# EasyEDA Pro project ProPrj_ZYNQ7020_V1_2024-12-31.epro, schematic ZYNQ7020_1

## Sheets
1 BANK34/35: Board Name: ZYNQ7020_V1; Create Date: 2024-12-19; Page Name: BANK34/35; Project Name: ZYNQ7020_V1; Schematic Name: ZYNQ7020_1; Update Date: 2024-12-19; Company: 嘉立创EDA; Page Size: A4; Version: V1.0
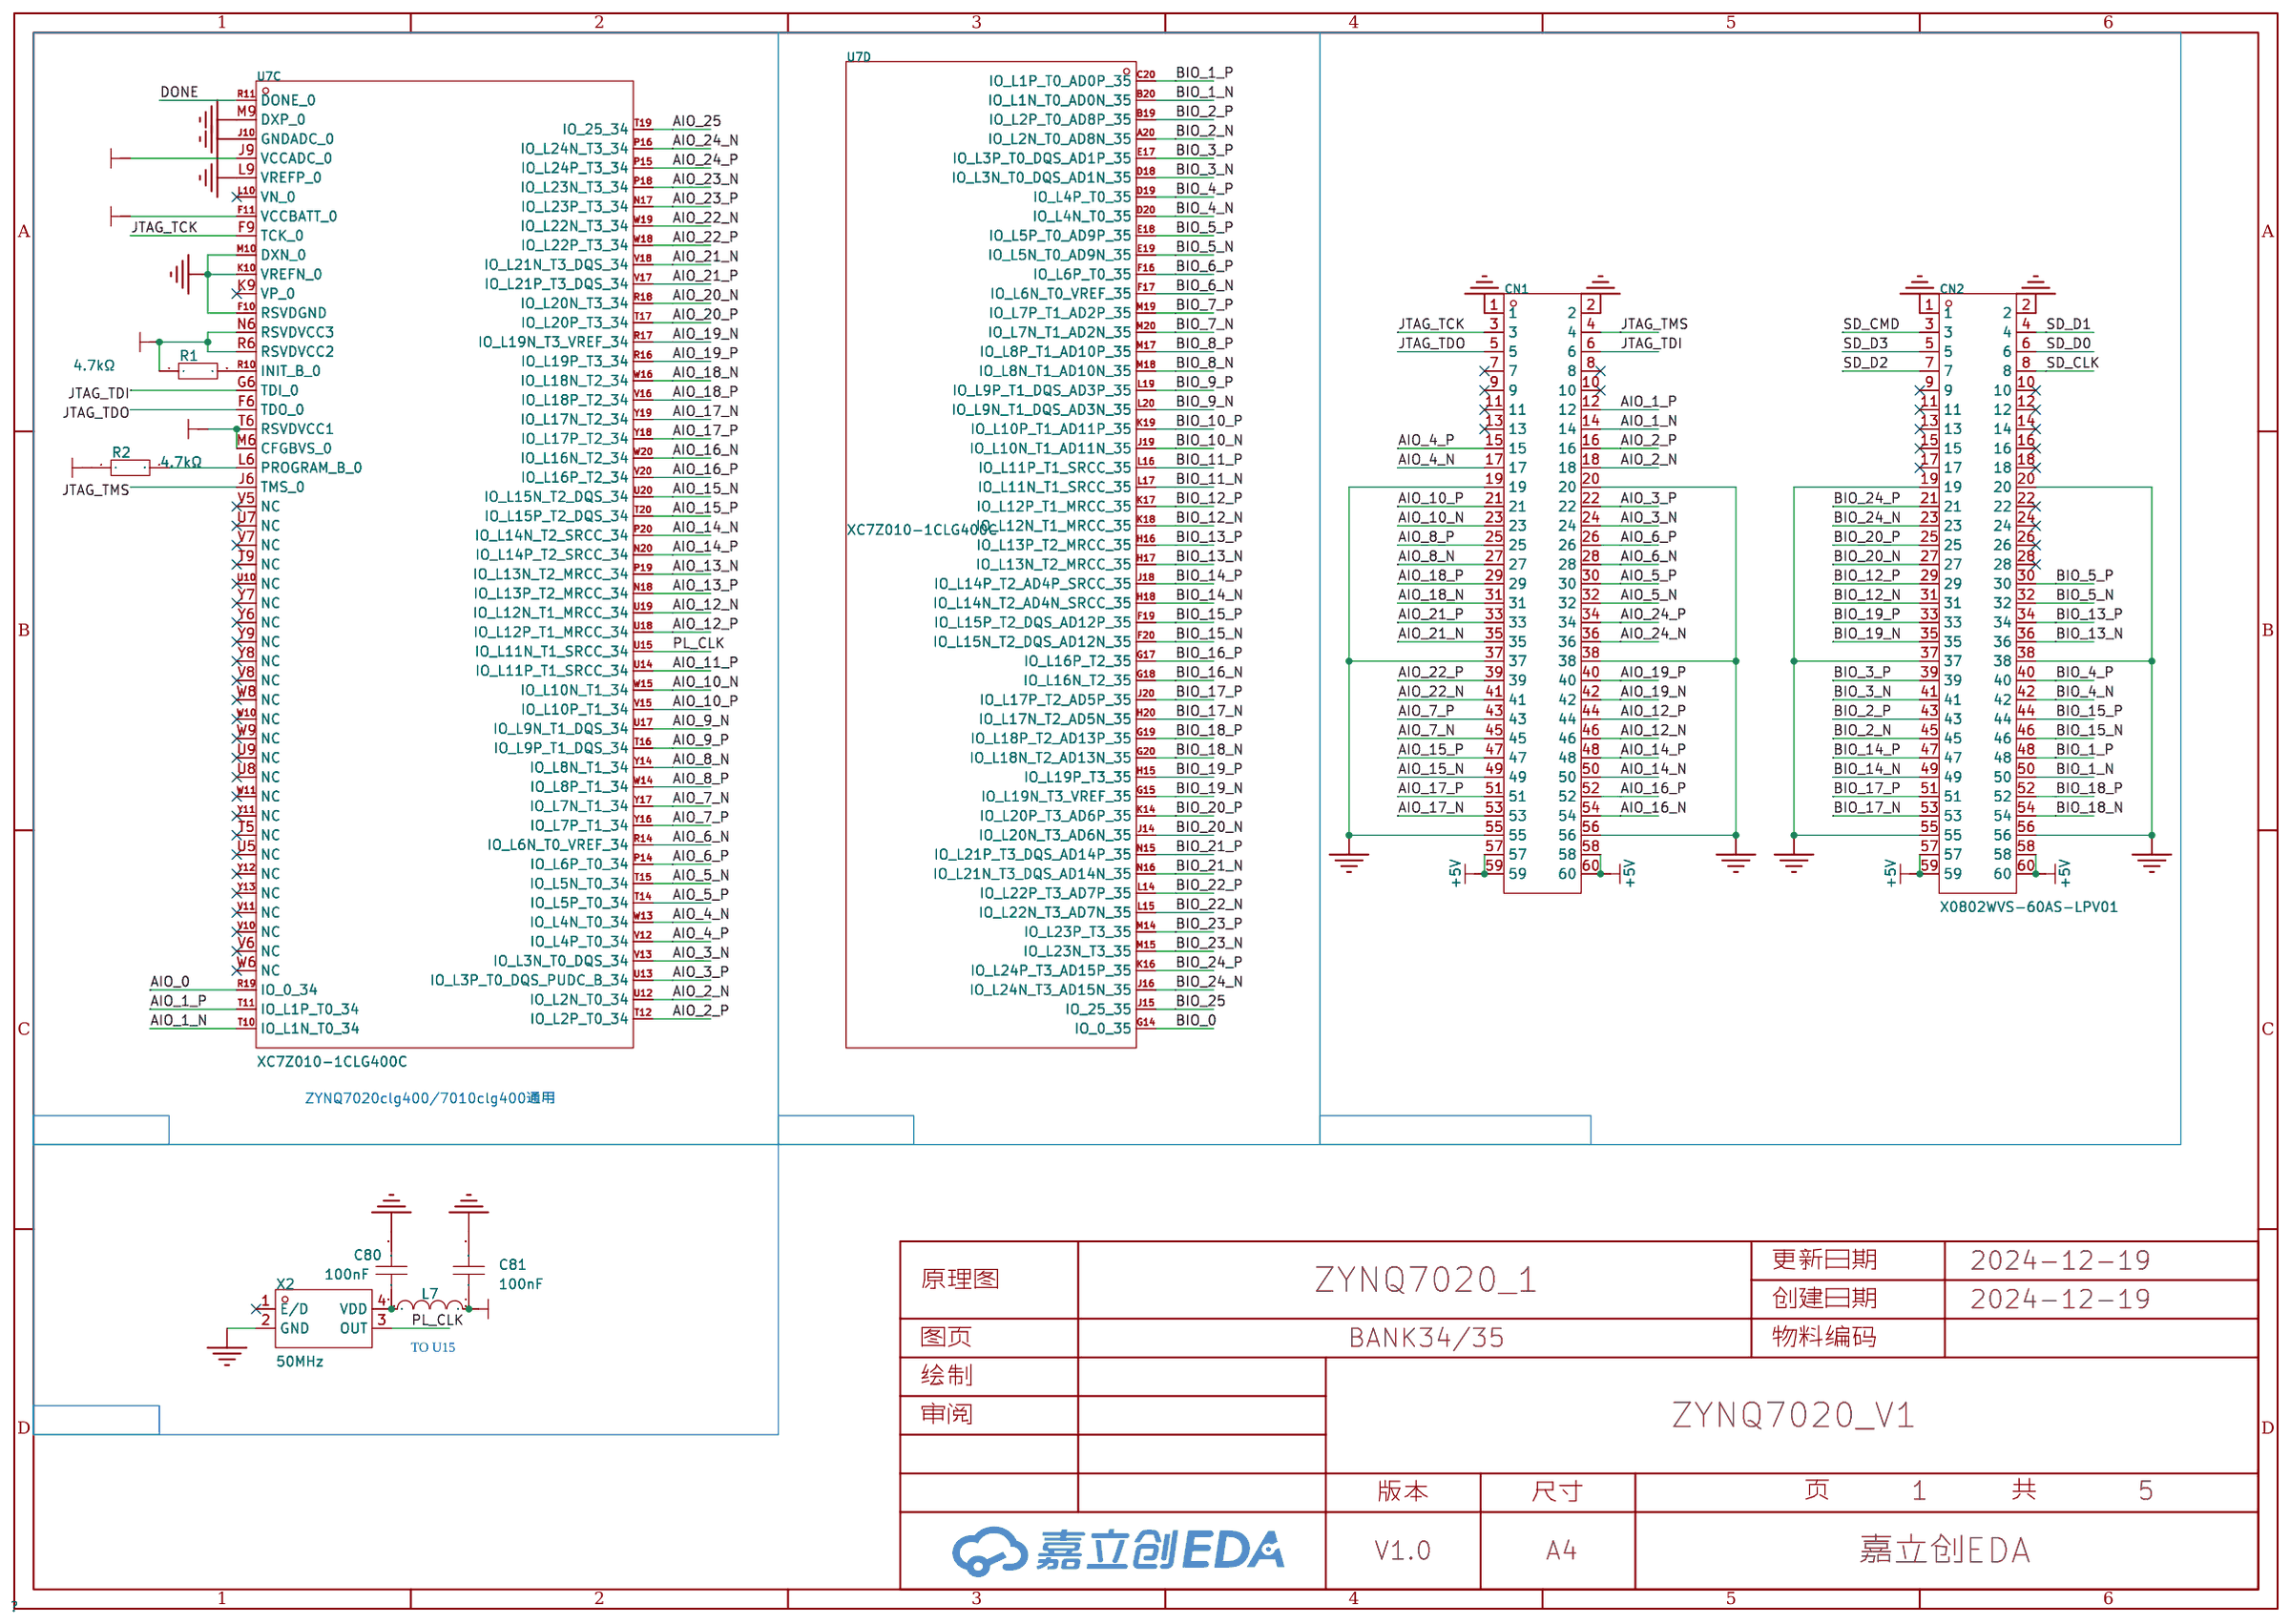
[diagram p0: BANK34/35]
2 POWER: Page Name: POWER
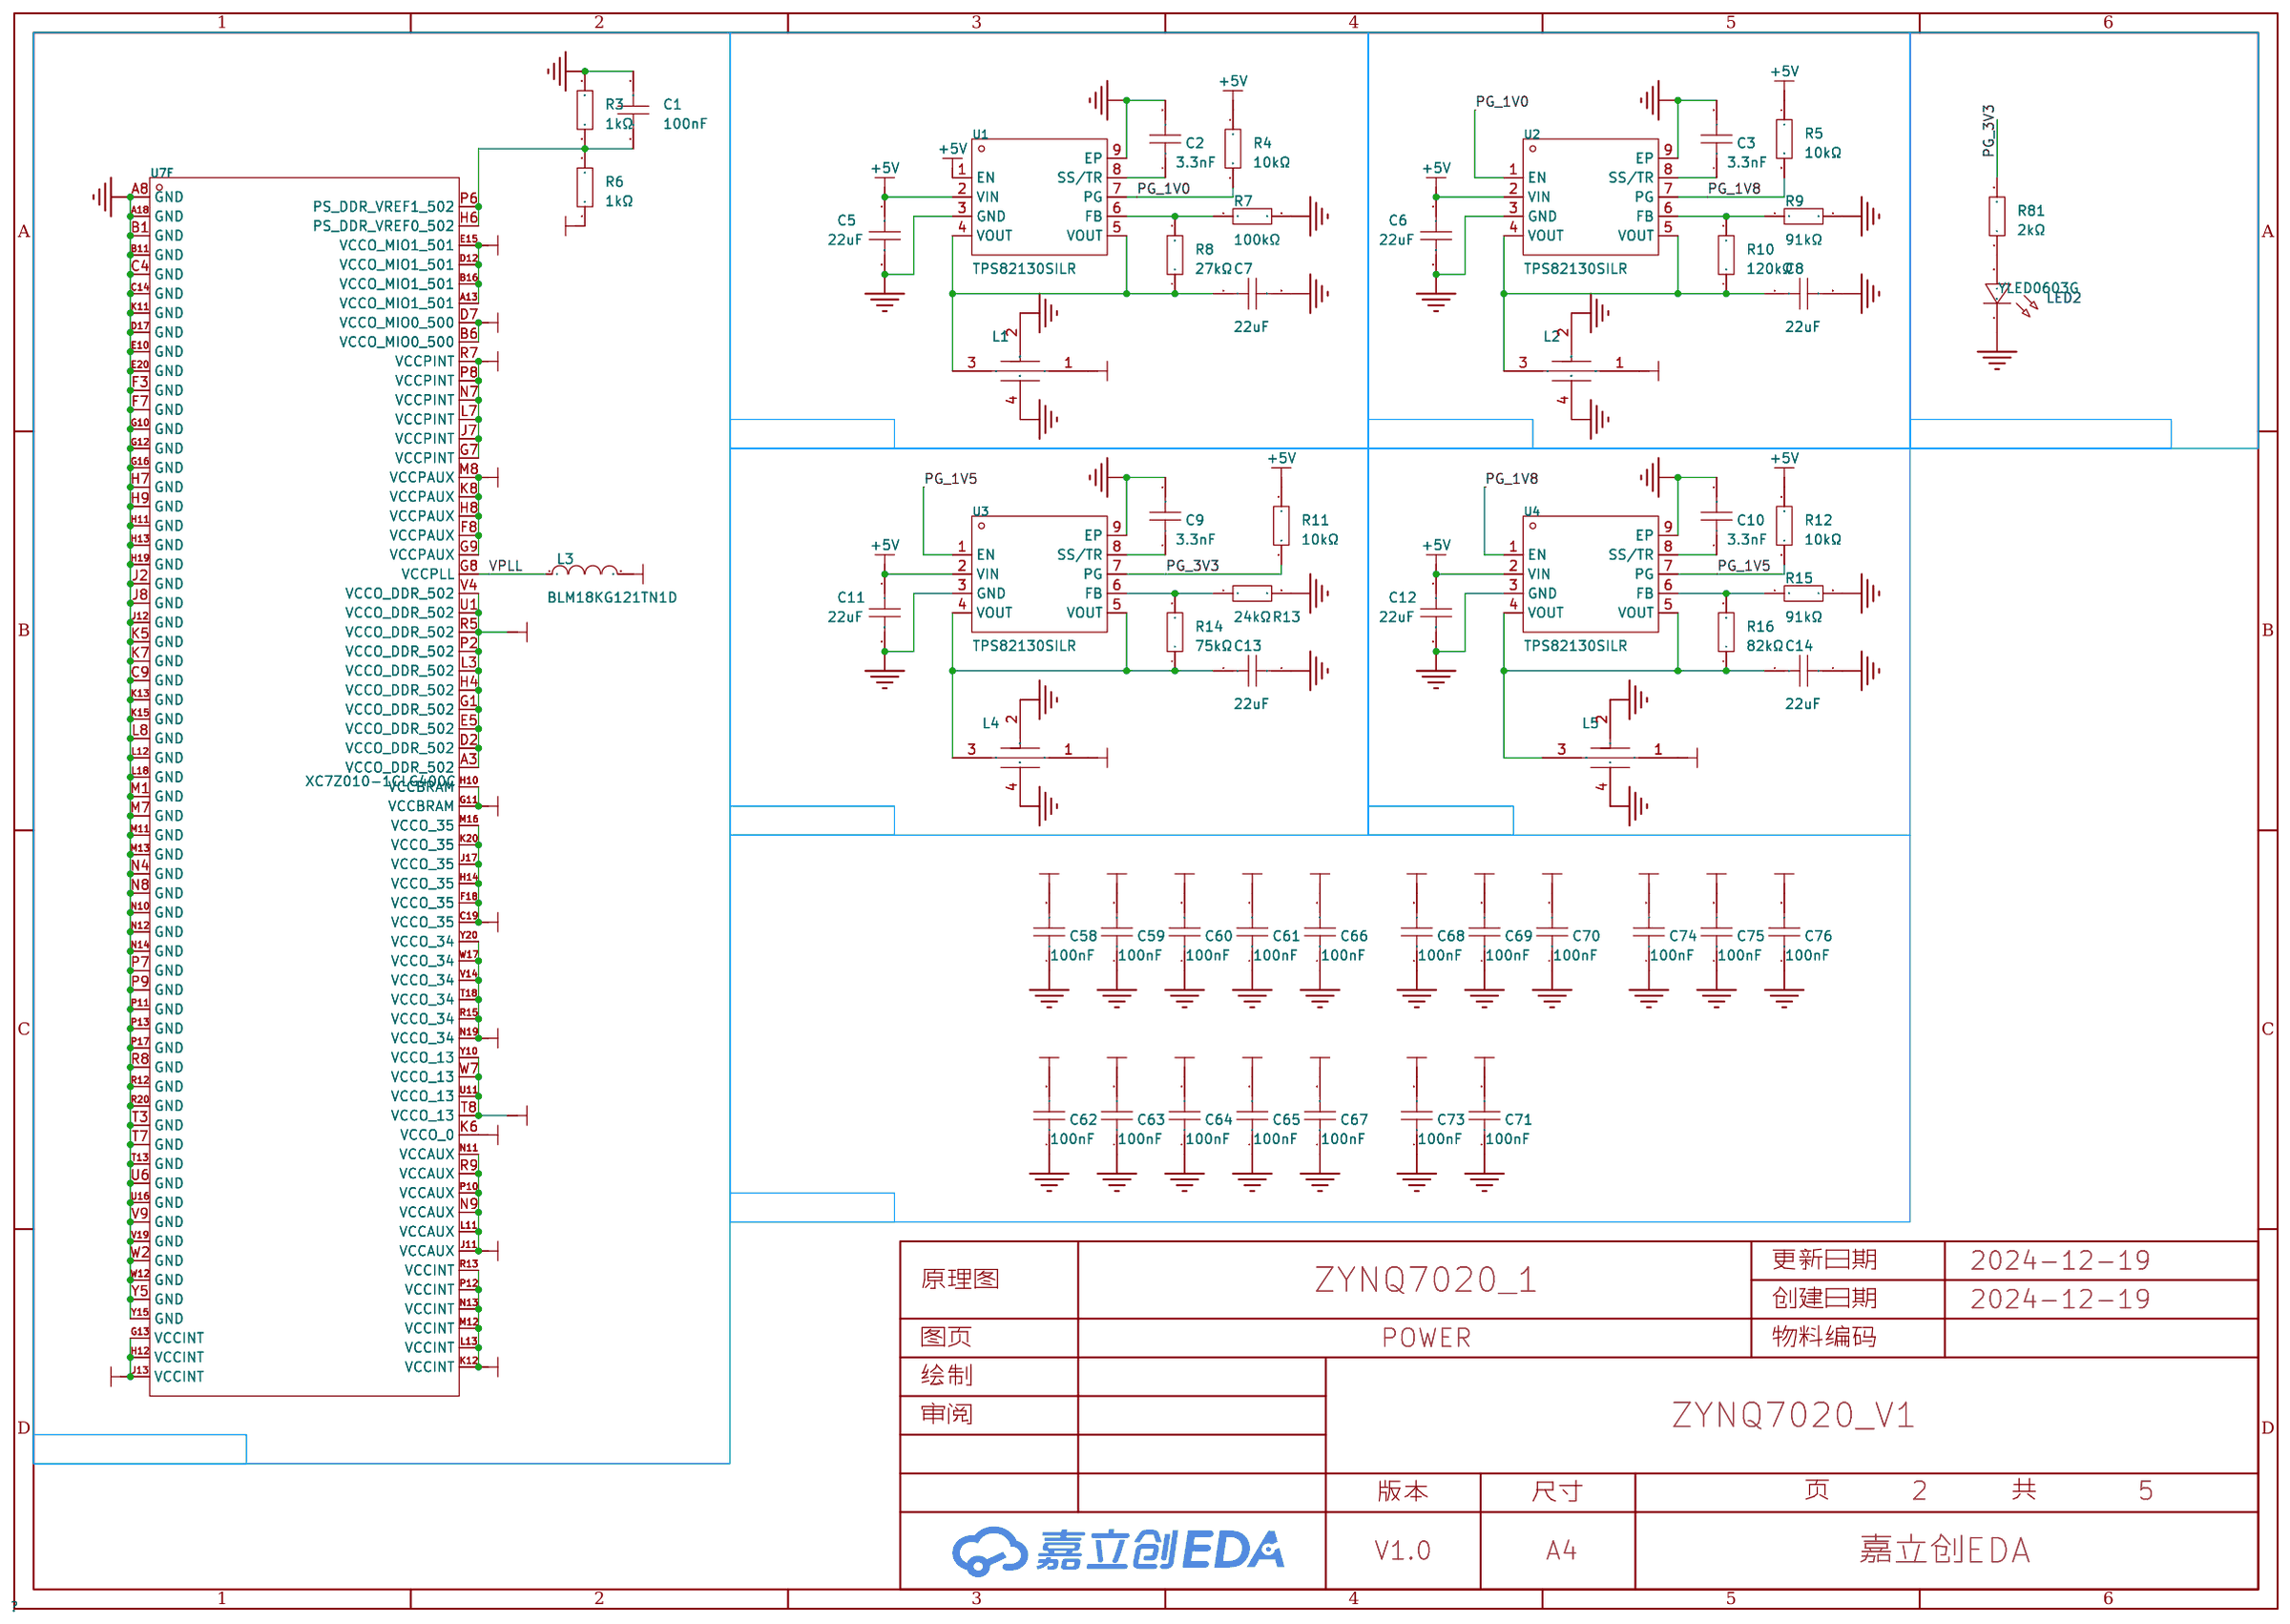
[diagram p1: POWER]
3 DDR3: Page Name: DDR3
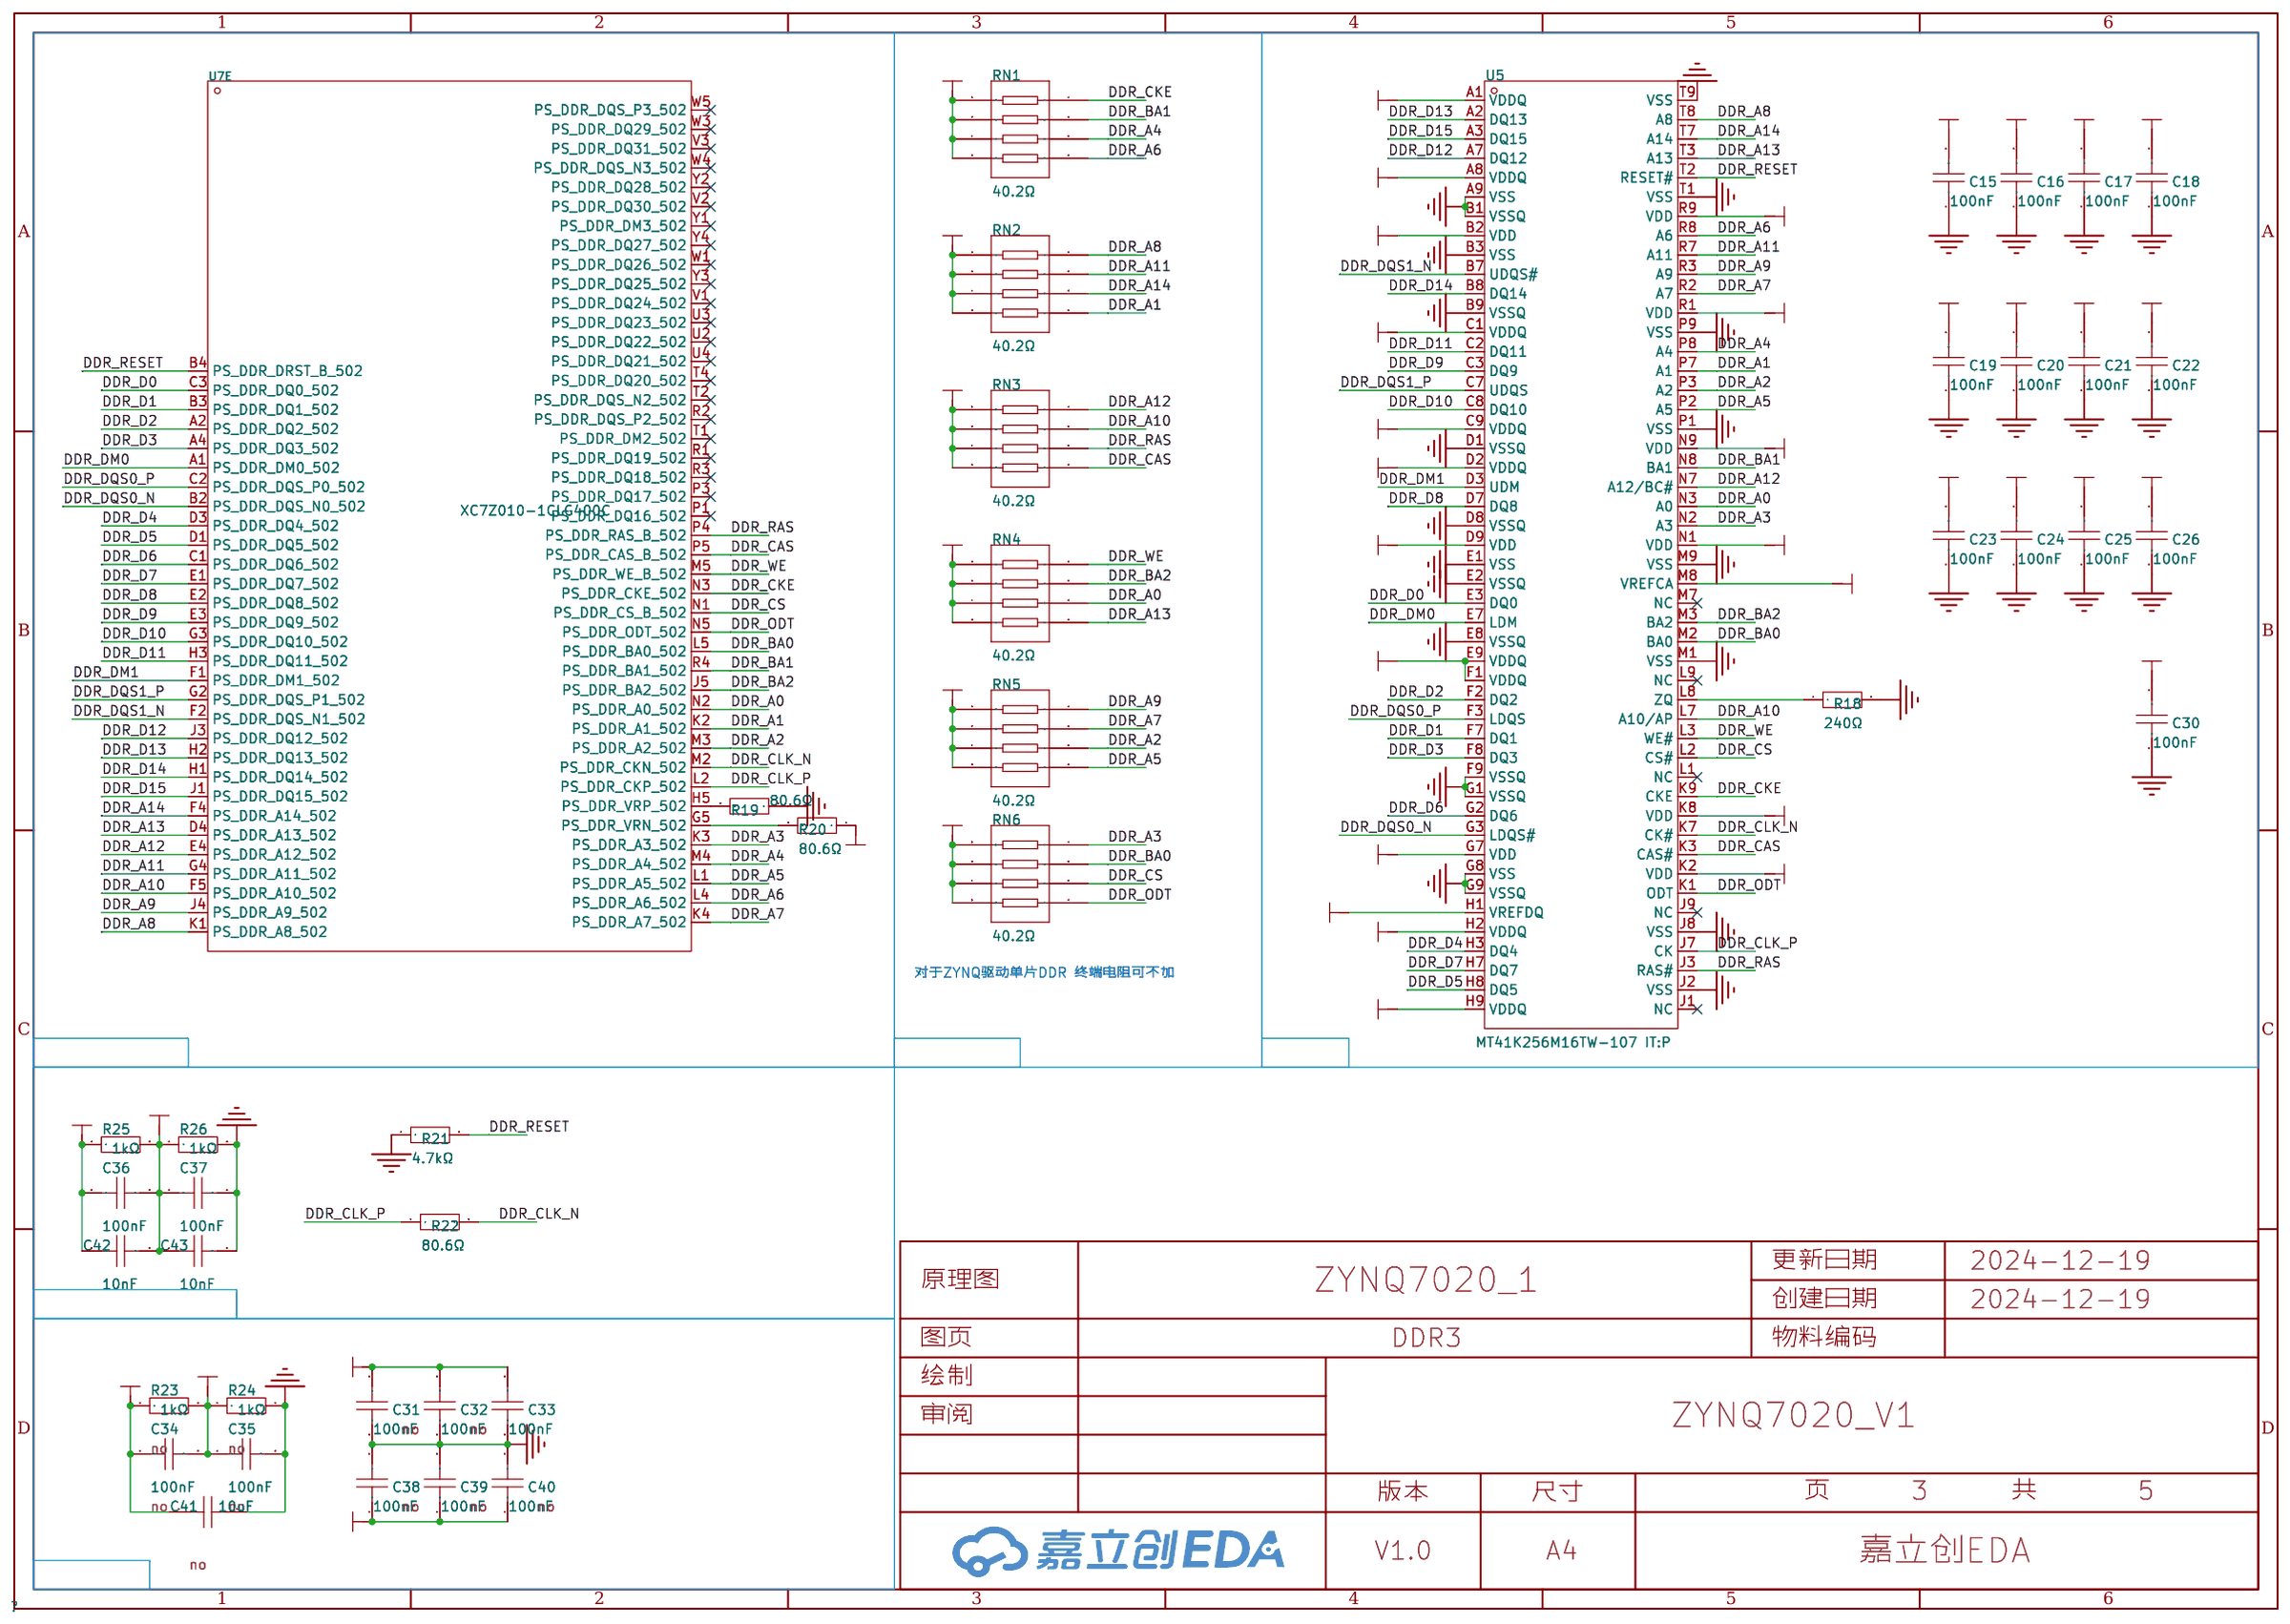
[diagram p2: DDR3]
4 BANK500/501: Page Name: BANK500/501
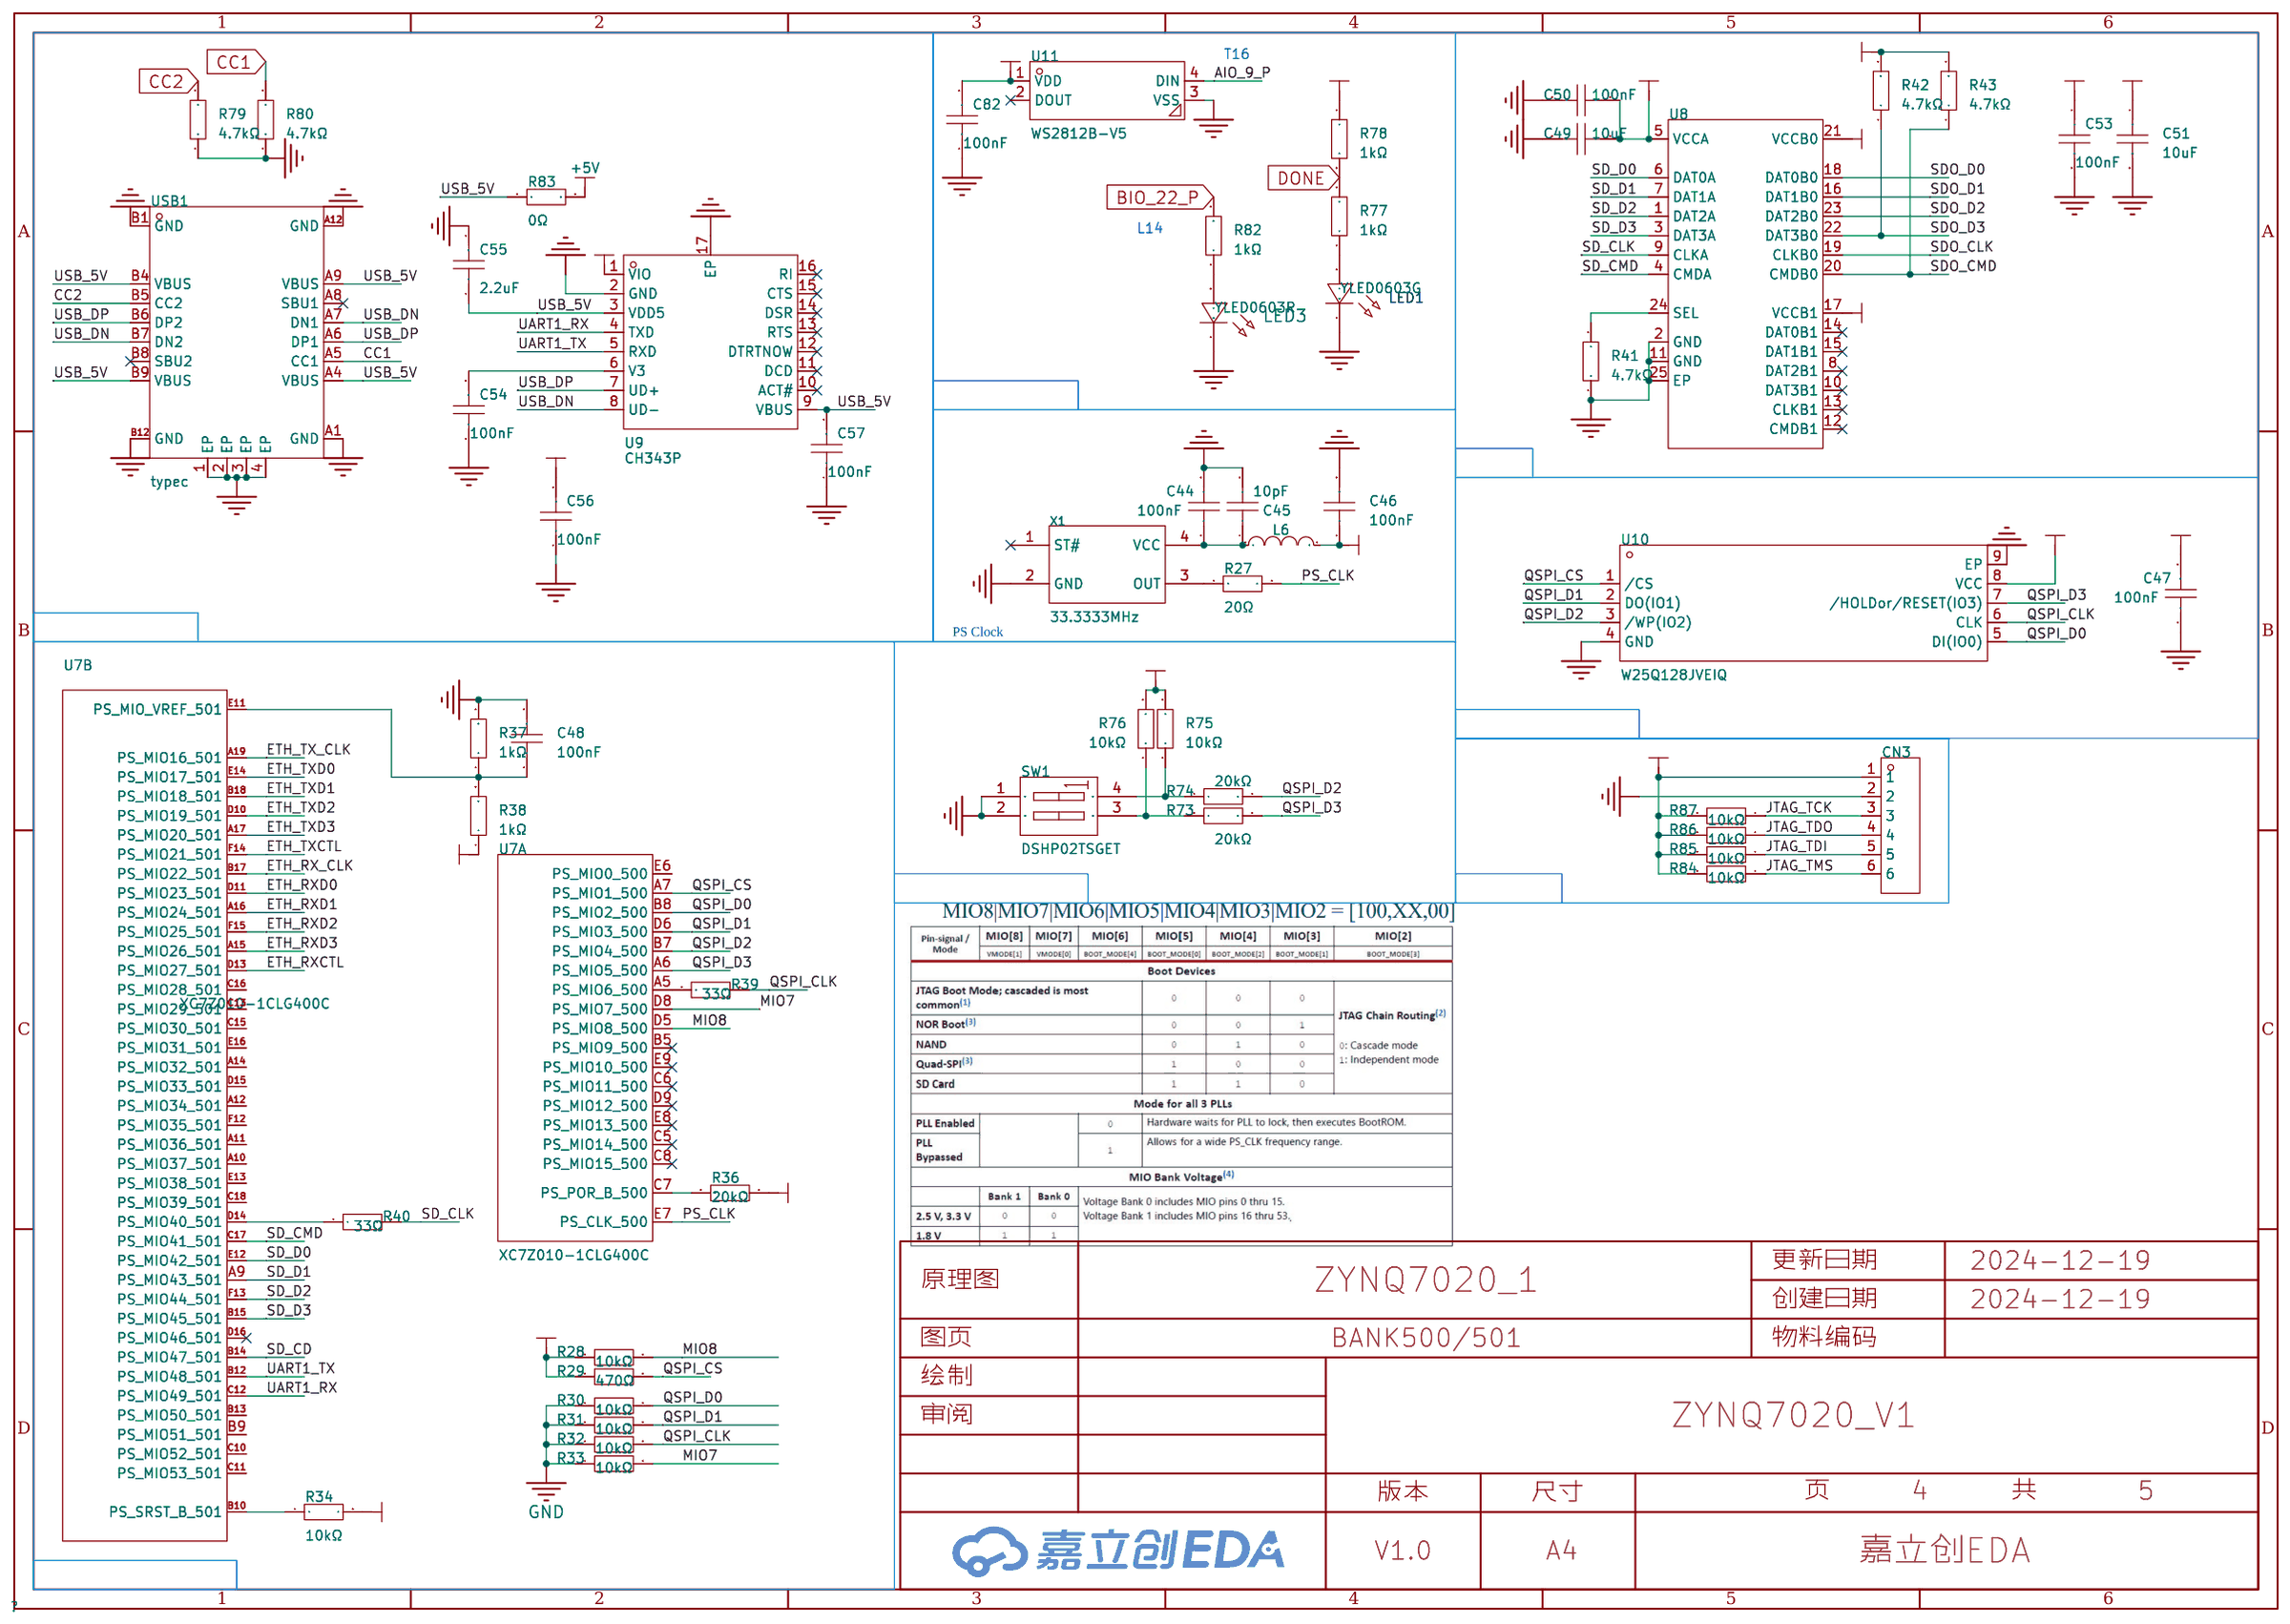
[diagram p3: BANK500/501]
5 CHANGELOG: Create Date: 2024-12-18; Page Name: CHANGELOG; Project Name: ZYNQ7020-core-board-series; Update Date: 2024-12-18
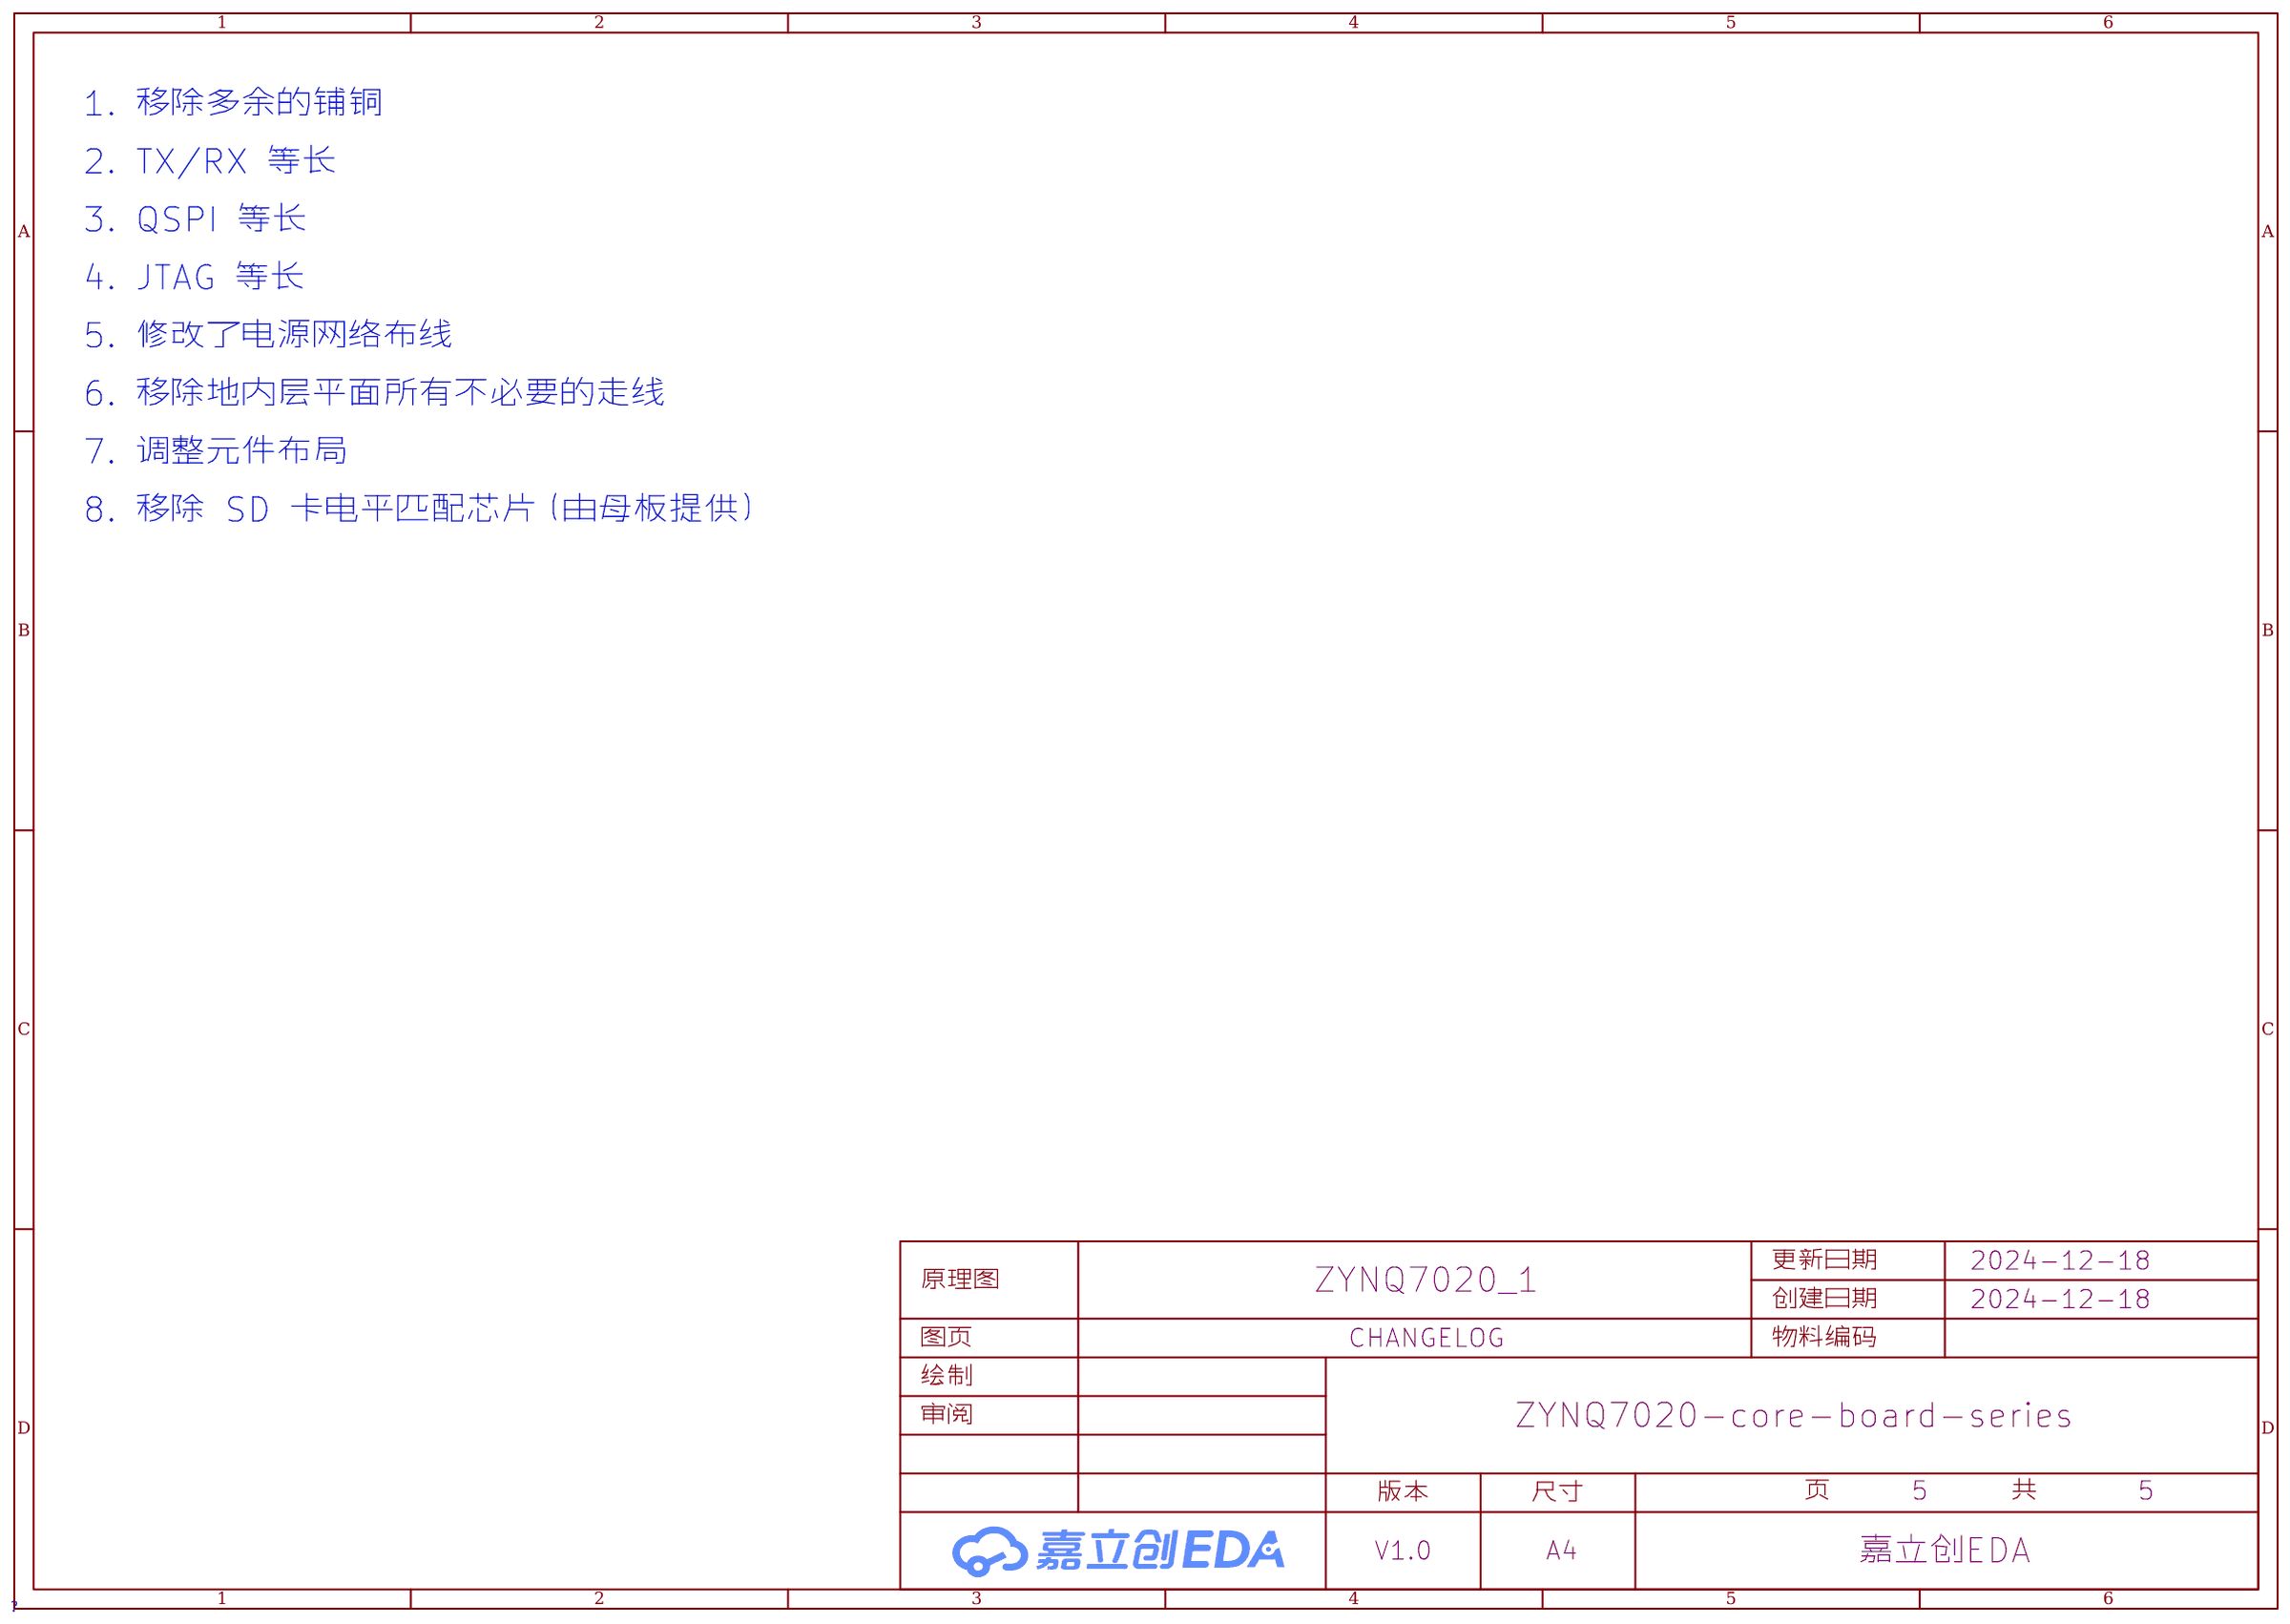
[diagram p4: CHANGELOG]

## Parts
sheet BANK34/35
C80  100nF  [C0402]
C81  100nF  [C0402]
CN1  X0802WVS-60AS-LPV01  [CONN-SMD_60P-P0.80_XKB_X0802WVS-60ADS-LPV01]
CN2  X0802WVS-60AS-LPV01  [CONN-SMD_60P-P0.80_XKB_X0802WVS-60ADS-LPV01]
L7  BLM18KG121TN1D  [L0603]
R1  4.7kΩ  [R0402]
R2  4.7kΩ  [R0402]
U7  XC7Z010-1CLG400C  [FBGA-400_L17.0-W17.0-R20-C20-P0.80-TL]  (sections 1,2,3,4,BANK500,BANK501)
X2  50MHz  [OSC-SMD_4P-L2.5-W2.0-BL]
sheet BANK500/501
C44  100nF  [C0402]
C45  10pF  [C0402]
C46  100nF  [C0402]
C47  100nF  [C0402]
C48  100nF  [C0402]
C49  10uF  [C0402]
C50  100nF  [C0402]
C51  10uF  [C0402]
C53  100nF  [C0402]
C54  100nF  [C0402]
C55  2.2uF  [C0402]
C56  100nF  [C0402]
C57  100nF  [C0402]
C82  100nF  [C0402]
CN3  X6511WRS-06H-C60D48  [HDR-SMD_6P-P2.54-H-M-W13.3-N]
L6  BLM18KG121TN1D  [L0603]
LED1  YLED0603G  [LED0603-FD]
LED3  YLED0603R  [LED0603-FD]
R27  20Ω  [R0402]
R28  10kΩ  [R0402]
R29  470Ω  [R0402]
R30  10kΩ  [R0402]
R31  10kΩ  [R0402]
R32  10kΩ  [R0402]
R33  10kΩ  [R0402]
R34  10kΩ  [R0402]
R36  20kΩ  [R0402]
R37  1kΩ  [R0402]
R38  1kΩ  [R0402]
R39  33Ω  [R0402]
R40  33Ω  [R0402]
R41  4.7kΩ  [R0402]
R42  4.7kΩ  [R0402]
R43  4.7kΩ  [R0402]
R73  20kΩ  [R0402]
R74  20kΩ  [R0402]
R75  10kΩ  [R0402]
R76  10kΩ  [R0402]
R77  1kΩ  [R0402]
R78  1kΩ  [R0402]
R79  4.7kΩ  [R0402]
R80  4.7kΩ  [R0402]
R82  1kΩ  [R0402]
R83  0Ω  [R0603]
R84  10kΩ  [R0402_NEW]
R85  10kΩ  [R0402_NEW]
R86  10kΩ  [R0402_NEW]
R87  10kΩ  [R0402_NEW]
SW1  DSHP02TSGET  [SW-SMD_4P_DSHP02TSGET]
U8  -  [WQFN-24_L4.0-W4.0-P0.50-TL-EP2.5]
U9  CH343P  [TQFN-16_L3.0-W3.0-P0.50-BL-EP1.7]
U10  W25Q128JVEIQ  [WSON-8_L6.0-W8.0-P1.27-BL-EP]
U11  WS2812B-V5  [LED-SMD_4P-L5.0-W5.0-TL_WS2812B-B]
USB1  typec  [USB-C-SMD_KH-TYPE-C-16P]
X1  33.3333MHz  [OSC-SMD_4P-L3.2-W2.5-BL]
sheet DDR3
C15  100nF  [C0402]
C16  100nF  [C0402]
C17  100nF  [C0402]
C18  100nF  [C0402]
C19  100nF  [C0402]
C20  100nF  [C0402]
C21  100nF  [C0402]
C22  100nF  [C0402]
C23  100nF  [C0402]
C24  100nF  [C0402]
C25  100nF  [C0402]
C26  100nF  [C0402]
C30  100nF  [C0402]
C31  100nF  [C0402]
C32  100nF  [C0402]
C33  100nF  [C0402]
C34  100nF  [C0402]
C35  100nF  [C0402]
C36  100nF  [C0402]
C37  100nF  [C0402]
C38  100nF  [C0402]
C39  100nF  [C0402]
C40  100nF  [C0402]
C41  10uF  [C0402]
C42  10nF  [C0402]
C43  10nF  [C0402]
R18  240Ω  [R0402]
R19  80.6Ω  [R0402]
R20  80.6Ω  [R0402]
R21  4.7kΩ  [R0402]
R22  80.6Ω  [R0402]
R23  1kΩ  [R0402]
R24  1kΩ  [R0402]
R25  1kΩ  [R0402]
R26  1kΩ  [R0402]
RN1  40.2Ω  [RES-ARRAY-SMD_0402-8P-L2.0-W1.0-BL]
RN2  40.2Ω  [RES-ARRAY-SMD_0402-8P-L2.0-W1.0-BL]
RN3  40.2Ω  [RES-ARRAY-SMD_0402-8P-L2.0-W1.0-BL]
RN4  40.2Ω  [RES-ARRAY-SMD_0402-8P-L2.0-W1.0-BL]
RN5  40.2Ω  [RES-ARRAY-SMD_0402-8P-L2.0-W1.0-BL]
RN6  40.2Ω  [RES-ARRAY-SMD_0402-8P-L2.0-W1.0-BL]
U5  MT41K256M16TW-107 IT:P  [FBGA-96_L14.0-W8.0-R16-C6-P0.80-TL]
sheet POWER
C1  100nF  [C0402]
C2  3.3nF  [C0402]
C3  3.3nF  [C0402]
C5  22uF  [C0805]
C6  22uF  [C0805]
C7  22uF  [C0805]
C8  22uF  [C0805]
C9  3.3nF  [C0402]
C10  3.3nF  [C0402]
C11  22uF  [C0805]
C12  22uF  [C0805]
C13  22uF  [C0805]
C14  22uF  [C0805]
C58  100nF  [C0402]
C59  100nF  [C0402]
C60  100nF  [C0402]
C61  100nF  [C0402]
C62  100nF  [C0402]
C63  100nF  [C0402]
C64  100nF  [C0402]
C65  100nF  [C0402]
C66  100nF  [C0402]
C67  100nF  [C0402]
C68  100nF  [C0402]
C69  100nF  [C0402]
C70  100nF  [C0402]
C71  100nF  [C0402]
C73  100nF  [C0402]
C74  100nF  [C0402]
C75  100nF  [C0402]
C76  100nF  [C0402]
L1  NFM21PC104R1E3D  [CAP-SMD_4P-L2.0-W1.25]
L2  NFM21PC104R1E3D  [CAP-SMD_4P-L2.0-W1.25]
L3  BLM18KG121TN1D  [L0603]
L4  NFM21PC104R1E3D  [CAP-SMD_4P-L2.0-W1.25]
L5  NFM21PC104R1E3D  [CAP-SMD_4P-L2.0-W1.25]
LED2  YLED0603G  [LED0603-FD]
R3  1kΩ  [R0402]
R4  10kΩ  [R0402]
R5  10kΩ  [R0402]
R6  1kΩ  [R0402]
R7  100kΩ  [R0402]
R8  27kΩ  [R0402]
R9  91kΩ  [R0402]
R10  120kΩ  [R0402]
R11  10kΩ  [R0402]
R12  10kΩ  [R0402]
R13  24kΩ  [R0402]
R14  75kΩ  [R0402]
R15  91kΩ  [R0402]
R16  82kΩ  [R0402]
R81  2kΩ  [R0402]
U1  TPS82130SILR  [USIP-8_L3.0-W2.8-P0.65-TL-EP]
U2  TPS82130SILR  [USIP-8_L3.0-W2.8-P0.65-TL-EP]
U3  TPS82130SILR  [USIP-8_L3.0-W2.8-P0.65-TL-EP]
U4  TPS82130SILR  [USIP-8_L3.0-W2.8-P0.65-TL-EP]

## Library data of the parts
C1 C15-C26 C30-C40 C44 C46-C48 C50 C53 C54 C56-C71 C73-C76 C80-C82 = GRM155R71H104KE14D: 容值:100nF;精度:±10%;额定电压:50V;材质(温度系数):X7R;; LCSC Part Name: 100nF ±10% 50V; Supplier Part: C77020; Manufacturer: muRata(村田); Supplier Footprint: 0402; JLCPCB Part Class: Extended Part; Datasheet: https://atta.szlcsc.com/upload/public/pdf/source/20180326/C77020_39BD49C951FF1AF0DB1F1FAC5AC1E401.pdf; Supplier: LCSC; Tolerance: ±10%; Voltage Rated: 50V; Temperature Coefficient: X7R
CN1 CN2 = X0802WVS-60AS-LPV01: PIN总数:60P;间距:0.8mm;公母:公;安装方式:立贴;行数:2;额定电流:500mA;工作温度范围:-25℃~+85℃;; LCSC Part Name: 间距:0.8mm PIN:60P 公 立贴; Supplier Part: C2925331; Manufacturer: XKB Connection(中国星坤); Supplier Footprint: SMD,P=0.8mm; JLCPCB Part Class: Extended Part; Datasheet: https://atta.szlcsc.com/upload/public/pdf/source/20211215/082FD9024D3D5655771ED54599ED55C7.pdf; Supplier: LCSC; Number of Pins: 60P; Pitch: 0.8mm; Number of Rows: 2; Gender: 公; Mounting Style: 立贴; Current Rating (Max): 500mA; Operating Temperature Range: -25℃~+85℃
L3 L6 L7 = BLM18KG121TN1D: 标称阻抗@测试频率:120Ω@100MHz;误差:±25%;直流电阻(RDC):30mΩ;; LCSC Part Name: 单路 0603磁珠 阻抗120Ω@100MHz; Supplier Part: C85831; Manufacturer: muRata(村田); Supplier Footprint: 0603; JLCPCB Part Class: Extended Part; Datasheet: https://atta.szlcsc.com/upload/public/pdf/source/20180329/C160981_FD3C2D2622A377E203B89F4AA32B0741.pdf; Supplier: LCSC; Impedance @ Frequency: 120Ω@100MHz; Tolerance: ±25%; DC Resistance: 30mΩ; Current Rating: 3A; Circuits: 1
R1 R2 R21 R41-R43 R79 R80 = 0402WGF4701TCE: 电阻类型:厚膜电阻;阻值:4.7kΩ;精度:±1%;功率:62.5mW;最大工作电压:50V;温度系数:±100ppm/℃;; LCSC Part Name: 4.7kΩ ±1% 62.5mW 厚膜电阻; Supplier Part: C25900; Manufacturer: UNI-ROYAL(厚声); Supplier Footprint: 0402; JLCPCB Part Class: Basic Part; Datasheet: https://atta.szlcsc.com/upload/public/pdf/source/20200306/C422600_1E6D84923E4A46A82E41ADD87F860B5C.pdf; Supplier: LCSC; Type: 厚膜电阻; Tolerance: ±1%; Power(Watts): 62.5mW; Overload Voltage (Max): 50V; Temperature Coefficient: ±100ppm/℃; Operating Temperature Range: -55℃~+155℃
U7 = XC7Z010-1CLG400C_C2843417: Supplier Part: C2843417; Manufacturer: XILINX(赛灵思); Supplier Footprint: CSPBGA-400; JLCPCB Part Class: Extended Part; Datasheet: https://atta.szlcsc.com/upload/public/pdf/source/20191108/C446028_7ED8319F1F88212BA1E5D387DA4ECDB9.pdf; Supplier: LCSC
X2 = OT252050MJBA4SL: 频率:50MHz;工作电压:1.8V~3.3V;频率稳定度:±10ppm;; LCSC Part Name: 50MHz ±10ppm 1.8V~3.3V YSO110TR; Supplier Part: C669074; Manufacturer: YXC(扬兴晶振); Supplier Footprint: SMD2520-4P; JLCPCB Part Class: 扩展库; Datasheet: https://atta.szlcsc.com/upload/public/pdf/source/20210329/C669065_30B18CFE780D377BA4E84F6ED1951959.pdf; Supplier: LCSC; Supply Voltage: 1.8V~3.3V; Supply Current (Max): 12mA; Frequency Stability: ±10ppm; Operating Temperature: -40℃~+85℃
C45 = GJM1555C1H100FB01D: 容值:10pF;精度:±1%;额定电压:50V;材质(温度系数):C0G;; LCSC Part Name: 10pF ±1% 50V; Supplier Part: C782046; Manufacturer: muRata(村田); Supplier Footprint: 0402; JLCPCB Part Class: Extended Part; Datasheet: https://atta.szlcsc.com/upload/public/pdf/source/20200908/C782046_6B495CB8BB5186DFA61FAFE383A0F7E0.pdf; Supplier: LCSC; Tolerance: ±1%; Voltage Rated: 50V; Temperature Coefficient: C0G
C41 C49 C51 = CL05A106MP5NUNC: 容值:10uF;精度:±20%;额定电压:10V;材质(温度系数):X5R;; LCSC Part Name: 10uF ±20% 10V; Supplier Part: C315248; Manufacturer: SAMSUNG(三星); Supplier Footprint: 0402; JLCPCB Part Class: Extended Part; Datasheet: https://atta.szlcsc.com/upload/public/pdf/source/20231220/1EF805BAE1520675928CC4638D279E74.pdf; Supplier: LCSC; Tolerance: ±20%; Voltage Rated: 10V; Temperature Coefficient: X5R
C55 = GRM155R61E225KE11D: 容值:2.2uF;精度:±10%;额定电压:25V;材质(温度系数):X5R;; LCSC Part Name: 2.2uF ±10% 25V; Supplier Part: C385032; Manufacturer: muRata(村田); Supplier Footprint: 0402; JLCPCB Part Class: Extended Part; Datasheet: https://atta.szlcsc.com/upload/public/pdf/source/20190531/C385032_AE390FF415271BC6A7223A7F56F516ED.pdf; Supplier: LCSC; Tolerance: ±10%; Voltage Rated: 25V; Temperature Coefficient: X5R
CN3 = X6511WRS-06H-C60D48: 插针结构:1x6P;间距:2.54mm;行距:2.54mm;圆针/方针:方针;安装类型:-;排数:单排;总PIN位数:6P;额定电流:3A;额定电压:250V;配合针长度:-;塑高:2.5mm;端接针长度:-;触头材质:黄铜;触头镀层:金;工作温度范围:-40℃~+105℃;焊接温度(最大值):260℃;颜色:黑色;; LCSC Part Name: 1x6P 间距:2.54mm 方针; Supplier Part: C5242199; Manufacturer: XKB Connection(中国星坤); Supplier Footprint: SMD,P=2.54mm; JLCPCB Part Class: 扩展库; Datasheet: https://atta.szlcsc.com/upload/public/pdf/source/20221103/EADF72CF36CD96D511D8188ACEE72315.pdf; Supplier: LCSC; Pin Structure: 1x6P; Pitch: 2.54mm; Row Spacing: 2.54mm; Circluar Pins/Square Pins: 方针; Number of Rows: 单排; Number of Pins: 6P; Current Rating (Max): 3A; Voltage Rating (Max): 250V; Insulation Height: 2.5mm; Contact Material: 黄铜; Contact Plating: 金; Operating Temperature Range: -40℃~+105℃; Soldering Temperature(Max): 260℃; Color: 黑色
LED1 LED2 = YLED0603G: 发光颜色:翠绿色;正向电压(VF):2.7V~3.2V;功率:-;正向电流:25mA;主波长:510nm~531nm;二极管配置:-;透镜颜色:-;色温:-;发光强度:-;发光角度:-;载带方式:-;工作温度:-40℃~+85℃;; Supplier Part: C19273151; Manufacturer: YONGYUTAI(永裕泰); Supplier Footprint: 0603; JLCPCB Part Class: Extended Part; Datasheet: https://atta.szlcsc.com/upload/public/pdf/source/20231201/6896CD173B7817C61CFF421DECB2B9C4.pdf; Supplier: LCSC; Emitted Color: 翠绿色; Forward Voltage (VF): 2.7V~3.2V; Forward Current: 25mA; Dominant Wavelength: 510nm~531nm; Operating Temperature: -40℃~+85℃
LED3 = YLED0603R: 发光颜色:红色;正向电压(VF):1.8V~2.4V;功率:-;正向电流:25mA;主波长:620nm~625nm;二极管配置:-;透镜颜色:-;色温:-;发光强度:-;发光角度:-;载带方式:-;工作温度:-40℃~+85℃;; Supplier Part: C19171390; Manufacturer: YONGYUTAI(永裕泰); Supplier Footprint: 0603; JLCPCB Part Class: Extended Part; Datasheet: https://atta.szlcsc.com/upload/public/pdf/source/20231027/FB19AF06E2C70028E58AB5CEDD1BDC72.pdf; Supplier: LCSC; Emitted Color: 红色; Forward Voltage (VF): 1.8V~2.4V; Forward Current: 25mA; Dominant Wavelength: 620nm~625nm; Operating Temperature: -40℃~+85℃
R27 = 0402WGF200JTCE: 电阻类型:厚膜电阻;阻值:20Ω;精度:±1%;功率:62.5mW;最大工作电压:50V;温度系数:±200ppm/℃;; LCSC Part Name: 20Ω ±1% 62.5mW 厚膜电阻; Supplier Part: C25089; Manufacturer: UNI-ROYAL(厚声); Supplier Footprint: 0402; JLCPCB Part Class: Extended Part; Datasheet: https://atta.szlcsc.com/upload/public/pdf/source/20200306/C422600_1E6D84923E4A46A82E41ADD87F860B5C.pdf; Supplier: LCSC; Type: 厚膜电阻; Tolerance: ±1%; Power(Watts): 62.5mW; Overload Voltage (Max): 50V; Temperature Coefficient: ±200ppm/℃; Operating Temperature Range: -55℃~+155℃
R4 R5 R11 R12 R28 R30-R34 R75 R76 R84-R87 = 0402WGF1002TCE: 电阻类型:厚膜电阻;阻值:10kΩ;精度:±1%;功率:62.5mW;最大工作电压:50V;温度系数:±100ppm/℃;; LCSC Part Name: 10kΩ ±1% 62.5mW 厚膜电阻; Supplier Part: C25744; Manufacturer: UNI-ROYAL(厚声); Supplier Footprint: 0402; JLCPCB Part Class: Basic Part; Datasheet: https://atta.szlcsc.com/upload/public/pdf/source/20200306/C422600_1E6D84923E4A46A82E41ADD87F860B5C.pdf; Supplier: LCSC; Type: 厚膜电阻; Tolerance: ±1%; Power(Watts): 62.5mW; Overload Voltage (Max): 50V; Temperature Coefficient: ±100ppm/℃; Operating Temperature Range: -55℃~+155℃
R29 = 0402WGF4700TCE: 电阻类型:厚膜电阻;阻值:470Ω;精度:±1%;功率:62.5mW;最大工作电压:50V;温度系数:±100ppm/℃;; LCSC Part Name: 470Ω ±1% 62.5mW 厚膜电阻; Supplier Part: C25117; Manufacturer: UNI-ROYAL(厚声); Supplier Footprint: 0402; JLCPCB Part Class: Basic Part; Datasheet: https://atta.szlcsc.com/upload/public/pdf/source/20200306/C422600_1E6D84923E4A46A82E41ADD87F860B5C.pdf; Supplier: LCSC; Type: 厚膜电阻; Tolerance: ±1%; Power(Watts): 62.5mW; Overload Voltage (Max): 50V; Temperature Coefficient: ±100ppm/℃; Operating Temperature Range: -55℃~+155℃
R36 = 0402WGF2002TCE: 电阻类型:厚膜电阻;阻值:20kΩ;精度:±1%;功率:62.5mW;最大工作电压:50V;温度系数:±100ppm/℃;; LCSC Part Name: 20kΩ ±1% 62.5mW; Supplier Part: C25765; Manufacturer: UNI-ROYAL(厚声); Supplier Footprint: 0402; JLCPCB Part Class: 基础库; Datasheet: https://atta.szlcsc.com/upload/public/pdf/source/20200306/C422600_1E6D84923E4A46A82E41ADD87F860B5C.pdf; Supplier: LCSC; Type: 厚膜电阻; Tolerance: ±1%; Power(Watts): 62.5mW; Temperature Coefficient: ±100ppm/℃; Overload Voltage (Max): 50V; Operating Temperature Range: -55℃~+155℃
R3 R6 R23-R26 R37 R38 R77 R78 R82 = 0402WGF1001TCE: 电阻类型:厚膜电阻;阻值:1kΩ;精度:±1%;功率:62.5mW;最大工作电压:50V;温度系数:±100ppm/℃;; LCSC Part Name: 1kΩ ±1% 62.5mW 厚膜电阻; Supplier Part: C11702; Manufacturer: UNI-ROYAL(厚声); Supplier Footprint: 0402; JLCPCB Part Class: Basic Part; Datasheet: https://atta.szlcsc.com/upload/public/pdf/source/20200306/C422600_1E6D84923E4A46A82E41ADD87F860B5C.pdf; Supplier: LCSC; Type: 厚膜电阻; Tolerance: ±1%; Power(Watts): 62.5mW; Overload Voltage (Max): 50V; Temperature Coefficient: ±100ppm/℃; Operating Temperature Range: -55℃~+155℃
R39 R40 = 0402WGF330JTCE: 电阻类型:厚膜电阻;阻值:33Ω;精度:±1%;功率:62.5mW;最大工作电压:50V;温度系数:±100ppm/℃;; LCSC Part Name: 33Ω ±1% 62.5mW 厚膜电阻; Supplier Part: C25105; Manufacturer: UNI-ROYAL(厚声); Supplier Footprint: 0402; JLCPCB Part Class: Basic Part; Datasheet: https://atta.szlcsc.com/upload/public/pdf/source/20200306/C422600_1E6D84923E4A46A82E41ADD87F860B5C.pdf; Supplier: LCSC; Type: 厚膜电阻; Tolerance: ±1%; Power(Watts): 62.5mW; Overload Voltage (Max): 50V; Temperature Coefficient: ±100ppm/℃; Operating Temperature Range: -55℃~+155℃
R73 R74 = 0402WGF2002TCE: 电阻类型:厚膜电阻;阻值:20kΩ;精度:±1%;功率:62.5mW;最大工作电压:50V;温度系数:±100ppm/℃;; LCSC Part Name: 20kΩ ±1% 62.5mW 厚膜电阻; Supplier Part: C25765; Manufacturer: UNI-ROYAL(厚声); Supplier Footprint: 0402; JLCPCB Part Class: Basic Part; Datasheet: https://atta.szlcsc.com/upload/public/pdf/source/20200306/C422600_1E6D84923E4A46A82E41ADD87F860B5C.pdf; Supplier: LCSC; Type: 厚膜电阻; Tolerance: ±1%; Power(Watts): 62.5mW; Temperature Coefficient: ±100ppm/℃; Overload Voltage (Max): 50V; Operating Temperature Range: -55℃~+155℃
R83 = 0603WAF0000T5E: 电阻类型:厚膜电阻;阻值:0Ω;精度:±1%;功率:100mW;最大工作电压:75V;; LCSC Part Name: 0Ω ±1% 100mW 厚膜电阻; Supplier Part: C21189; Manufacturer: UNI-ROYAL(厚声); Supplier Footprint: 0603; JLCPCB Part Class: Basic Part; Datasheet: https://atta.szlcsc.com/upload/public/pdf/source/20200306/C422600_1E6D84923E4A46A82E41ADD87F860B5C.pdf; Supplier: LCSC; Type: 厚膜电阻; Tolerance: ±1%; Power(Watts): 100mW; Overload Voltage (Max): 75V; Operating Temperature Range: -55℃~+155℃
SW1 = DSHP02TSGET: 类型:平拨，凹槽式;电路结构:单刀单掷;开关位数:2;引脚间距:1.27mm;颜色:黑色;; LCSC Part Name: 2位 1.27间距; Supplier Part: C40735; Manufacturer: YE; Supplier Footprint: SMD-4P,4.1x5.4mm; JLCPCB Part Class: Extended Part; Datasheet: https://atta.szlcsc.com/upload/public/pdf/source/20150928/1457707425261.pdf; Supplier: LCSC; Type: 平拨，凹槽式; Circuit: 单刀单掷; Number of Positions: 2; Lead Pitch: 1.27mm; Color: 黑色
U8 = TXS02612RTWR: TXS02612 具有电压电平转换功能的 SDIO 端口扩展器; Supplier Part: C140276; Manufacturer: TI(德州仪器); Supplier Footprint: WQFN-24_EP; JLCPCB Part Class: 扩展库; Datasheet: https://atta.szlcsc.com/upload/public/pdf/source/20180326/C140276_E5B046A739454B25517A7E1AD4B10154.pdf; Supplier: LCSC
U9 = CH343P: 应用功能:-;接口协议:-;; Supplier Part: C2846043; Manufacturer: WCH(南京沁恒); Supplier Footprint: TQFN-16-EP(3x3); JLCPCB Part Class: 扩展库; Datasheet: https://atta.szlcsc.com/upload/public/pdf/source/20211010/C2846043_7FA705E1F14A2906F6A2AFA45FA28209.pdf; Supplier: LCSC
U10 = W25Q128JVEIQ: Supplier Part: C401662; Manufacturer: WINBOND(华邦); Supplier Footprint: WSON-8-EP(6x8); JLCPCB Part Class: 扩展库; Datasheet: https://atta.szlcsc.com/upload/public/pdf/source/20190705/C401662_06B6D416F67ED315879B366F63A3F7C9.pdf; Supplier: LCSC
U11 = WS2812B-V5: Supplier Part: C691873; Supplier Footprint: SMD,5x5mm; Supplier: LCSC
USB1 = typec: Supplier Part: C9900016956; Supplier Footprint: typec 12p; JLCPCB Part Class: 扩展库; Supplier: LCSC
X1 = OT322533.3333MJBA4SL: 频率:33.3333MHz;常温频差:±10ppm;输出模式:CMOS;工作电压:1.8V~3.3V;频率稳定度(全温):±20ppm;; LCSC Part Name: 33.3333MHz ±10ppm 1.8V~3.3V YSO110TR; Supplier Part: C2831392; Manufacturer: YXC(扬兴晶振); Supplier Footprint: SMD3225-4P; JLCPCB Part Class: Extended Part; Datasheet: https://atta.szlcsc.com/upload/public/pdf/source/20240329/730BB30F784D239B033636DF5970F6CE.pdf; Supplier: LCSC; Normal temperature Frequency Tolerance: ±10ppm; Output Type: CMOS; Supply Voltage: 1.8V~3.3V; Frequency Stability(Full temperature range): ±20ppm; Operating Temperature: -40℃~+85℃
C42 C43 = CC0402KRX7R9BB103: 容值:10nF;精度:±10%;额定电压:50V;材质(温度系数):X7R;; LCSC Part Name: 10nF ±10% 50V; Supplier Part: C60133; Manufacturer: YAGEO(国巨); Supplier Footprint: 0402; JLCPCB Part Class: Extended Part; Datasheet: https://atta.szlcsc.com/upload/public/pdf/source/20180224/C181747_15194369449651363981.pdf; Supplier: LCSC; Tolerance: ±10%; Voltage Rated: 50V; Temperature Coefficient: X7R
R18 = 0402WGF2400TCE: 电阻类型:厚膜电阻;阻值:240Ω;精度:±1%;功率:62.5mW;最大工作电压:50V;温度系数:±100ppm/℃;; LCSC Part Name: 240Ω ±1% 62.5mW 厚膜电阻; Supplier Part: C25094; Manufacturer: UNI-ROYAL(厚声); Supplier Footprint: 0402; JLCPCB Part Class: Extended Part; Datasheet: https://atta.szlcsc.com/upload/public/pdf/source/20200306/C422600_1E6D84923E4A46A82E41ADD87F860B5C.pdf; Supplier: LCSC; Type: 厚膜电阻; Tolerance: ±1%; Power(Watts): 62.5mW; Overload Voltage (Max): 50V; Temperature Coefficient: ±100ppm/℃; Operating Temperature Range: -55℃~+155℃
R19 R20 R22 = 0402WGF806JTCE: 电阻类型:厚膜电阻;阻值:80.6Ω;精度:±1%;功率:62.5mW;最大工作电压:50V;温度系数:±100ppm/℃;; LCSC Part Name: 80.6Ω ±1% 62.5mW 厚膜电阻; Supplier Part: C25134; Manufacturer: UNI-ROYAL(厚声); Supplier Footprint: 0402; JLCPCB Part Class: Extended Part; Datasheet: https://atta.szlcsc.com/upload/public/pdf/source/20200306/C422600_1E6D84923E4A46A82E41ADD87F860B5C.pdf; Supplier: LCSC; Type: 厚膜电阻; Tolerance: ±1%; Power(Watts): 62.5mW; Overload Voltage (Max): 50V; Temperature Coefficient: ±100ppm/℃; Operating Temperature Range: -55℃~+155℃
RN1-RN6 = YC124-FR-0740R2L: 电阻器数:4;阻值:40.2Ω;精度:±1%;单个元件功率:62.5mW;温度系数:±200ppm/℃;; LCSC Part Name: 40.2Ω ±1% 0402x4; Supplier Part: C728737; Manufacturer: YAGEO(国巨); Supplier Footprint: 0402x4; JLCPCB Part Class: Extended Part; Datasheet: https://atta.szlcsc.com/upload/public/pdf/source/20181031/C327050_39CFA27C782DBE929FAF5847D7485F94.pdf; Supplier: LCSC; Number of Resistors: 4; Tolerance: ±1%; Power(Watts): 62.5mW; Temperature Coefficient: ±200ppm/℃; Number of Pins: 8
U5 = MT41K256M16TW-107 IT:P: Supplier Part: C367428; Manufacturer: micron(镁光); Supplier Footprint: FBGA-96; JLCPCB Part Class: 扩展库; Datasheet: https://atta.szlcsc.com/upload/public/pdf/source/20201223/C367428_E750824A5A9FE6A8314900D5BED43FEA.pdf; Supplier: LCSC
C2 C3 C9 C10 = CC0402KRX7R9BB332: 容值:3.3nF;精度:±10%;额定电压:50V;材质(温度系数):X7R;; LCSC Part Name: 3.3nF ±10% 50V; Supplier Part: C107028; Manufacturer: YAGEO(国巨); Supplier Footprint: 0402; JLCPCB Part Class: Extended Part; Datasheet: https://atta.szlcsc.com/upload/public/pdf/source/20170914/C128857_1505359892143968080.pdf; Supplier: LCSC; Tolerance: ±10%; Voltage Rated: 50V; Temperature Coefficient: X7R
C5-C8 C11-C14 = CL21A226MAQNNNE: 容值:22uF;精度:±20%;额定电压:25V;材质(温度系数):X5R;; LCSC Part Name: 22uF ±20% 25V; Supplier Part: C45783; Manufacturer: SAMSUNG(三星); Supplier Footprint: 0805; JLCPCB Part Class: Basic Part; Datasheet: https://atta.szlcsc.com/upload/public/pdf/source/20160218/1457707763339.pdf; Supplier: LCSC; Tolerance: ±20%; Voltage Rated: 25V; Temperature Coefficient: X5R
L1 L2 L4 L5 = NFM21PC104R1E3D: 电容量:100nF;精度:±20%;直流电阻:30mΩ;; LCSC Part Name: 100nF(104) ±20% 25V; Supplier Part: C86150; Manufacturer: muRata(村田); Supplier Footprint: 0805; JLCPCB Part Class: 扩展库; Datasheet: https://atta.szlcsc.com/upload/public/pdf/source/20180326/C86150_E4B7366323682FA84DED9003C68CA797.pdf; Supplier: LCSC; Nominal Capacitance: 100nF; CapacitanceTolerance: ±20%; DC Rated Voltage: 25V; Rated Current: 2A; DC Resistance: 30mΩ; Operating Temperature: -55℃~+125℃
R7 = RC0402FR-07100KL: 电阻类型:厚膜电阻;阻值:100kΩ;精度:±1%;功率:62.5mW;最大工作电压:50V;温度系数:±100ppm/℃;; LCSC Part Name: 厚膜电阻 100kΩ ±1% 62.5mW; Supplier Part: C60491; Manufacturer: YAGEO(国巨); Supplier Footprint: 0402; JLCPCB Part Class: Extended Part; Datasheet: https://atta.szlcsc.com/upload/public/pdf/source/20180927/C295883_E8D83085EA81BD7DE0B2B681138C15EE.pdf; Supplier: LCSC; Type: 厚膜电阻; Tolerance: ±1%; Power(Watts): 62.5mW; Overload Voltage (Max): 50V; Temperature Coefficient: ±100ppm/℃; Operating Temperature Range: -55℃~+155℃
R8 = 0402WGF2702TCE: 电阻类型:厚膜电阻;阻值:27kΩ;精度:±1%;功率:62.5mW;最大工作电压:50V;温度系数:±100ppm/℃;; LCSC Part Name: 27kΩ ±1% 62.5mW 厚膜电阻; Supplier Part: C25771; Manufacturer: UNI-ROYAL(厚声); Supplier Footprint: 0402; JLCPCB Part Class: Extended Part; Datasheet: https://atta.szlcsc.com/upload/public/pdf/source/20200306/C422600_1E6D84923E4A46A82E41ADD87F860B5C.pdf; Supplier: LCSC; Type: 厚膜电阻; Tolerance: ±1%; Power(Watts): 62.5mW; Overload Voltage (Max): 50V; Temperature Coefficient: ±100ppm/℃; Operating Temperature Range: -55℃~+155℃
R9 R15 = 0402WGF9102TCE: 电阻类型:厚膜电阻;阻值:91kΩ;精度:±1%;功率:62.5mW;最大工作电压:50V;温度系数:±100ppm/℃;; LCSC Part Name: 91kΩ ±1% 62.5mW 厚膜电阻; Supplier Part: C4147; Manufacturer: UNI-ROYAL(厚声); Supplier Footprint: 0402; JLCPCB Part Class: Extended Part; Datasheet: https://atta.szlcsc.com/upload/public/pdf/source/20200306/C422600_1E6D84923E4A46A82E41ADD87F860B5C.pdf; Supplier: LCSC; Type: 厚膜电阻; Tolerance: ±1%; Power(Watts): 62.5mW; Overload Voltage (Max): 50V; Temperature Coefficient: ±100ppm/℃; Operating Temperature Range: -55℃~+155℃
R10 = 0402WGF1203TCE: 电阻类型:厚膜电阻;阻值:120kΩ;精度:±1%;功率:62.5mW;最大工作电压:50V;温度系数:±100ppm/℃;; LCSC Part Name: 120kΩ ±1% 62.5mW 厚膜电阻; Supplier Part: C25750; Manufacturer: UNI-ROYAL(厚声); Supplier Footprint: 0402; JLCPCB Part Class: Extended Part; Datasheet: https://atta.szlcsc.com/upload/public/pdf/source/20200306/C422600_1E6D84923E4A46A82E41ADD87F860B5C.pdf; Supplier: LCSC; Type: 厚膜电阻; Tolerance: ±1%; Power(Watts): 62.5mW; Overload Voltage (Max): 50V; Temperature Coefficient: ±100ppm/℃; Operating Temperature Range: -55℃~+155℃
R13 = 0402WGF2402TCE: 电阻类型:厚膜电阻;阻值:24kΩ;精度:±1%;功率:62.5mW;最大工作电压:50V;温度系数:±100ppm/℃;; LCSC Part Name: 24kΩ ±1% 62.5mW 厚膜电阻; Supplier Part: C25769; Manufacturer: UNI-ROYAL(厚声); Supplier Footprint: 0402; JLCPCB Part Class: Extended Part; Datasheet: https://atta.szlcsc.com/upload/public/pdf/source/20200306/C422600_1E6D84923E4A46A82E41ADD87F860B5C.pdf; Supplier: LCSC; Type: 厚膜电阻; Tolerance: ±1%; Power(Watts): 62.5mW; Overload Voltage (Max): 50V; Temperature Coefficient: ±100ppm/℃; Operating Temperature Range: -55℃~+155℃
R14 = 0402WGF7502TCE: 电阻类型:厚膜电阻;阻值:75kΩ;精度:±1%;功率:62.5mW;最大工作电压:50V;温度系数:±100ppm/℃;; LCSC Part Name: 75kΩ ±1% 62.5mW 厚膜电阻; Supplier Part: C25798; Manufacturer: UNI-ROYAL(厚声); Supplier Footprint: 0402; JLCPCB Part Class: Extended Part; Datasheet: https://atta.szlcsc.com/upload/public/pdf/source/20200306/C422600_1E6D84923E4A46A82E41ADD87F860B5C.pdf; Supplier: LCSC; Type: 厚膜电阻; Tolerance: ±1%; Power(Watts): 62.5mW; Overload Voltage (Max): 50V; Temperature Coefficient: ±100ppm/℃; Operating Temperature Range: -55℃~+155℃
R16 = RC0402FR-0782KL: 电阻类型:厚膜电阻;阻值:82kΩ;精度:±1%;功率:62.5mW;最大工作电压:50V;温度系数:±100ppm/℃;; LCSC Part Name: 厚膜电阻 82kΩ ±1% 62.5mW; Supplier Part: C137932; Manufacturer: YAGEO(国巨); Supplier Footprint: 0402; JLCPCB Part Class: Extended Part; Datasheet: https://atta.szlcsc.com/upload/public/pdf/source/20181009/C309620_DA5935B6E1D48212CB7A533FE518B3C2.pdf; Supplier: LCSC; Type: 厚膜电阻; Tolerance: ±1%; Power(Watts): 62.5mW; Overload Voltage (Max): 50V; Temperature Coefficient: ±100ppm/℃; Operating Temperature Range: -55℃~+155℃
R81 = 0402WGF2001TCE: 电阻类型:厚膜电阻;阻值:2kΩ;精度:±1%;功率:62.5mW;最大工作电压:50V;温度系数:±100ppm/℃;; LCSC Part Name: 2kΩ ±1% 62.5mW 厚膜电阻; Supplier Part: C4109; Manufacturer: UNI-ROYAL(厚声); Supplier Footprint: 0402; JLCPCB Part Class: Basic Part; Datasheet: https://atta.szlcsc.com/upload/public/pdf/source/20200306/C422600_1E6D84923E4A46A82E41ADD87F860B5C.pdf; Supplier: LCSC; Type: 厚膜电阻; Tolerance: ±1%; Power(Watts): 62.5mW; Overload Voltage (Max): 50V; Temperature Coefficient: ±100ppm/℃; Operating Temperature Range: -55℃~+155℃
U1-U4 = TPS82130SILR: 输入电压(DC):3V~17V;输出电压:900mV~6V;输出电流(最大值):3A;; Supplier Part: C473914; Manufacturer: TI(德州仪器); Supplier Footprint: USIP-8; JLCPCB Part Class: 扩展库; Datasheet: https://www.ti.com/cn/lit/gpn/tps82130; Supplier: LCSC; Output Channel: 1; Input Voltage(DC): 3V~17V; Output Voltage: 900mV~6V; Output Current (Max): 3A

## Nets
1V0: C68.2 C69.2 C70.2 C71.2 C73.2 L1.1(IN) U7.G7(VCCPINT) U7.G11(VCCBRAM) U7.G13(VCCINT) U7.H10(VCCBRAM) U7.H12(VCCINT) U7.J7(VCCPINT) U7.J13(VCCINT) U7.K12(VCCINT) U7.L7(VCCPINT) U7.L13(VCCINT) U7.M12(VCCINT) U7.N7(VCCPINT) U7.N13(VCCINT) U7.P8(VCCPINT) U7.P12(VCCINT) U7.R7(VCCPINT) U7.R13(VCCINT)
1V5: C15.2 C16.2 C17.2 C18.2 C19.2 C20.2 C21.2 C22.2 C23.2 C24.2 C25.2 C26.2 C30.2 C34.1 C36.1 C41.1 C42.1 L5.1(IN) R6.1 R20.1 R23.1 R25.1 U5.A1(VDDQ) U5.A8(VDDQ) U5.B2(VDD) U5.C1(VDDQ) U5.C9(VDDQ) U5.D2(VDDQ) U5.D9(VDD) U5.E9(VDDQ) U5.F1(VDDQ) U5.G7(VDD) U5.H2(VDDQ) U5.H9(VDDQ) U5.K2(VDD) U5.K8(VDD) U5.N1(VDD) U5.N9(VDD) U5.R1(VDD) U5.R9(VDD) U7.A3(VCCO_DDR_502) U7.D2(VCCO_DDR_502) U7.E5(VCCO_DDR_502) U7.G1(VCCO_DDR_502) U7.H4(VCCO_DDR_502) U7.L3(VCCO_DDR_502) U7.P2(VCCO_DDR_502) U7.R5(VCCO_DDR_502) U7.U1(VCCO_DDR_502) U7.V4(VCCO_DDR_502)
1V8: C49.1 C50.1 C56.2 C74.2 C75.2 C76.2 L2.1(IN) L3.2 R34.2 R38.1 U7.A13(VCCO_MIO1_501) U7.B16(VCCO_MIO1_501) U7.D12(VCCO_MIO1_501) U7.E15(VCCO_MIO1_501) U7.F8(VCCPAUX) U7.F11(VCCBATT_0) U7.G9(VCCPAUX) U7.H8(VCCPAUX) U7.J9(VCCADC_0) U7.J11(VCCAUX) U7.K8(VCCPAUX) U7.L11(VCCAUX) U7.M8(VCCPAUX) U7.N9(VCCAUX) U7.N11(VCCAUX) U7.P10(VCCAUX) U7.R9(VCCAUX) U8.5(VCCA) U9.1(VIO)
3V3: C46.1 C47.2 C51.1 C53.1 C58.2 C59.2 C60.2 C61.2 C62.2 C63.2 C64.2 C65.2 C66.2 C67.2 C81.1 C82.2 CN3.1 L4.1(IN) L6.2 L7.2 R1.1 R2.1 R28.1 R29.1 R36.1 R42.2 R43.2 R75.2 R76.2 R78.1 R84.2 R85.2 R86.2 R87.2 U7.B6(VCCO_MIO0_500) U7.C19(VCCO_35) U7.D7(VCCO_MIO0_500) U7.F18(VCCO_35) U7.H14(VCCO_35) U7.J17(VCCO_35) U7.K6(VCCO_0) U7.K20(VCCO_35) U7.M6(CFGBVS_0) U7.M16(VCCO_35) U7.N6(RSVDVCC3) U7.N19(VCCO_34) U7.R6(RSVDVCC2) U7.R15(VCCO_34) U7.T6(RSVDVCC1) U7.T8(VCCO_13) U7.T18(VCCO_34) U7.U11(VCCO_13) U7.V14(VCCO_34) U7.W7(VCCO_13) U7.W17(VCCO_34) U7.Y10(VCCO_13) U7.Y20(VCCO_34) U8.17(VCCB1) U8.21(VCCB0) U10.8(VCC) U11.1(VDD)
+5V: C5.1 C6.1 C11.1 C12.1 CN1.57 CN1.58 CN1.59 CN1.60 CN2.57 CN2.58 CN2.59 CN2.60 R4.1 R5.1 R11.1 R12.2 R83.2 U1.1(EN) U1.2(VIN) U2.2(VIN) U3.2(VIN) U4.2(VIN)
GND: C1.2 C2.2 C3.2 C5.2 C6.2 C7.2 C8.2 C9.2 C10.2 C11.2 C12.2 C13.2 C14.2 C15.1 C16.1 C17.1 C18.1 C19.1 C20.1 C21.1 C22.1 C23.1 C24.1 C25.1 C26.1 C30.1 C31.1 C32.1 C33.1 C35.2 C37.2 C38.2 C39.2 C40.2 C41.2 C43.2 C44.2 C45.2 C46.2 C47.1 C48.2 C49.2 C50.2 C51.2 C53.2 C54.1 C55.2 C56.1 C57.1 C58.1 C59.1 C60.1 C61.1 C62.1 C63.1 C64.1 C65.1 C66.1 C67.1 C68.1 C69.1 C70.1 C71.1 C73.1 C74.1 C75.1 C76.1 C80.2 C81.2 C82.1 CN1.1 CN1.2 CN1.19 CN1.20 CN1.37 CN1.38 CN1.55 CN1.56 CN2.1 CN2.2 CN2.19 CN2.20 CN2.37 CN2.38 CN2.55 CN2.56 CN3.2 L1.2(GND) L1.4(GND) L2.2(GND) L2.4(GND) L4.2(GND) L4.4(GND) L5.2(GND) L5.4(GND) LED1.1(C) LED2.1(C) LED3.1(C) R3.2 R7.2 R9.2 R13.2 R15.2 R18.2 R19.1 R21.1 R24.2 R26.2 R30.1 R31.1 R32.1 R33.1 R37.2 R41.1 R79.1 R80.1 SW1.1(A1) SW1.2(A2) U1.3(GND) U1.9(EP) U2.3(GND) U2.9(EP) U3.3(GND) U3.9(EP) U4.3(GND) U4.9(EP) U5.A9(VSS) U5.B1(VSSQ) U5.B3(VSS) U5.B9(VSSQ) U5.D1(VSSQ) U5.D8(VSSQ) U5.E1(VSS) U5.E2(VSSQ) U5.E8(VSSQ) U5.F9(VSSQ) U5.G1(VSSQ) U5.G8(VSS) U5.G9(VSSQ) U5.J2(VSS) U5.J8(VSS) U5.M1(VSS) U5.M9(VSS) U5.P1(VSS) U5.P9(VSS) U5.T1(VSS) U5.T9(VSS) U7.A8(GND) U7.A18(GND) U7.B1(GND) U7.B11(GND) U7.C4(GND) U7.C9(GND) U7.C14(GND) U7.D17(GND) U7.E10(GND) U7.E20(GND) U7.F3(GND) U7.F7(GND) U7.F10(RSVDGND) U7.G10(GND) U7.G12(GND) U7.G16(GND) U7.H7(GND) U7.H9(GND) U7.H11(GND) U7.H13(GND) U7.H19(GND) U7.J2(GND) U7.J8(GND) U7.J10(GNDADC_0) U7.J12(GND) U7.K5(GND) U7.K7(GND) U7.K10(VREFN_0) U7.K11(GND) U7.K13(GND) U7.K15(GND) U7.L8(GND) U7.L9(VREFP_0) U7.L12(GND) U7.L18(GND) U7.M1(GND) U7.M7(GND) U7.M9(DXP_0) U7.M10(DXN_0) U7.M11(GND) U7.M13(GND) U7.N4(GND) U7.N8(GND) U7.N10(GND) U7.N12(GND) U7.N14(GND) U7.P7(GND) U7.P9(GND) U7.P11(GND) U7.P13(GND) U7.P17(GND) U7.R8(GND) U7.R12(GND) U7.R20(GND) U7.T3(GND) U7.T7(GND) U7.T13(GND) U7.U6(GND) U7.U16(GND) U7.V9(GND) U7.V19(GND) U7.W2(GND) U7.W12(GND) U7.Y5(GND) U7.Y15(GND) U8.2(GND) U8.11(GND) U8.25(EP) U9.2(GND) U9.17(EP) U10.4(GND) U10.9(EP) U11.3(VSS) USB1.1(EP) USB1.2(EP) USB1.3(EP) USB1.4(EP) USB1.A1(GND) USB1.A12(GND) USB1.B1(GND) USB1.B12(GND) X1.2(GND) X2.2(GND)
AIO_0: U7.R19(IO_0_34)
AIO_1_N: CN1.14 U7.T10(IO_L1N_T0_34)
AIO_1_P: CN1.12 U7.T11(IO_L1P_T0_34)
AIO_2_N: CN1.18 U7.U12(IO_L2N_T0_34)
AIO_2_P: CN1.16 U7.T12(IO_L2P_T0_34)
AIO_3_N: CN1.24 U7.V13(IO_L3N_T0_DQS_34)
AIO_3_P: CN1.22 U7.U13(IO_L3P_T0_DQS_PUDC_B_34)
AIO_4_N: CN1.17 U7.W13(IO_L4N_T0_34)
AIO_4_P: CN1.15 U7.V12(IO_L4P_T0_34)
AIO_5_N: CN1.32 U7.T15(IO_L5N_T0_34)
AIO_5_P: CN1.30 U7.T14(IO_L5P_T0_34)
AIO_6_N: CN1.28 U7.R14(IO_L6N_T0_VREF_34)
AIO_6_P: CN1.26 U7.P14(IO_L6P_T0_34)
AIO_7_N: CN1.45 U7.Y17(IO_L7N_T1_34)
AIO_7_P: CN1.43 U7.Y16(IO_L7P_T1_34)
AIO_8_N: CN1.27 U7.Y14(IO_L8N_T1_34)
AIO_8_P: CN1.25 U7.W14(IO_L8P_T1_34)
AIO_9_N: U7.U17(IO_L9N_T1_DQS_34)
AIO_9_P: U7.T16(IO_L9P_T1_DQS_34) U11.4(DIN)
AIO_10_N: CN1.23 U7.W15(IO_L10N_T1_34)
AIO_10_P: CN1.21 U7.V15(IO_L10P_T1_34)
AIO_11_P: U7.U14(IO_L11P_T1_SRCC_34)
AIO_12_N: CN1.46 U7.U19(IO_L12N_T1_MRCC_34)
AIO_12_P: CN1.44 U7.U18(IO_L12P_T1_MRCC_34)
AIO_13_N: U7.P19(IO_L13N_T2_MRCC_34)
AIO_13_P: U7.N18(IO_L13P_T2_MRCC_34)
AIO_14_N: CN1.50 U7.P20(IO_L14N_T2_SRCC_34)
AIO_14_P: CN1.48 U7.N20(IO_L14P_T2_SRCC_34)
AIO_15_N: CN1.49 U7.U20(IO_L15N_T2_DQS_34)
AIO_15_P: CN1.47 U7.T20(IO_L15P_T2_DQS_34)
AIO_16_N: CN1.54 U7.W20(IO_L16N_T2_34)
AIO_16_P: CN1.52 U7.V20(IO_L16P_T2_34)
AIO_17_N: CN1.53 U7.Y19(IO_L17N_T2_34)
AIO_17_P: CN1.51 U7.Y18(IO_L17P_T2_34)
AIO_18_N: CN1.31 U7.W16(IO_L18N_T2_34)
AIO_18_P: CN1.29 U7.V16(IO_L18P_T2_34)
AIO_19_N: CN1.42 U7.R17(IO_L19N_T3_VREF_34)
AIO_19_P: CN1.40 U7.R16(IO_L19P_T3_34)
AIO_20_N: U7.R18(IO_L20N_T3_34)
AIO_20_P: U7.T17(IO_L20P_T3_34)
AIO_21_N: CN1.35 U7.V18(IO_L21N_T3_DQS_34)
AIO_21_P: CN1.33 U7.V17(IO_L21P_T3_DQS_34)
AIO_22_N: CN1.41 U7.W19(IO_L22N_T3_34)
AIO_22_P: CN1.39 U7.W18(IO_L22P_T3_34)
AIO_23_N: U7.P18(IO_L23N_T3_34)
AIO_23_P: U7.N17(IO_L23P_T3_34)
AIO_24_N: CN1.36 U7.P16(IO_L24N_T3_34)
AIO_24_P: CN1.34 U7.P15(IO_L24P_T3_34)
AIO_25: U7.T19(IO_25_34)
BIO_0: U7.G14(IO_0_35)
BIO_1_N: CN2.50 U7.B20(IO_L1N_T0_AD0N_35)
BIO_1_P: CN2.48 U7.C20(IO_L1P_T0_AD0P_35)
BIO_2_N: CN2.45 U7.A20(IO_L2N_T0_AD8N_35)
BIO_2_P: CN2.43 U7.B19(IO_L2P_T0_AD8P_35)
BIO_3_N: CN2.41 U7.D18(IO_L3N_T0_DQS_AD1N_35)
BIO_3_P: CN2.39 U7.E17(IO_L3P_T0_DQS_AD1P_35)
BIO_4_N: CN2.42 U7.D20(IO_L4N_T0_35)
BIO_4_P: CN2.40 U7.D19(IO_L4P_T0_35)
BIO_5_N: CN2.32 U7.E19(IO_L5N_T0_AD9N_35)
BIO_5_P: CN2.30 U7.E18(IO_L5P_T0_AD9P_35)
BIO_6_N: U7.F17(IO_L6N_T0_VREF_35)
BIO_6_P: U7.F16(IO_L6P_T0_35)
BIO_7_N: U7.M20(IO_L7N_T1_AD2N_35)
BIO_7_P: U7.M19(IO_L7P_T1_AD2P_35)
BIO_8_N: U7.M18(IO_L8N_T1_AD10N_35)
BIO_8_P: U7.M17(IO_L8P_T1_AD10P_35)
BIO_9_N: U7.L20(IO_L9N_T1_DQS_AD3N_35)
BIO_9_P: U7.L19(IO_L9P_T1_DQS_AD3P_35)
BIO_10_N: U7.J19(IO_L10N_T1_AD11N_35)
BIO_10_P: U7.K19(IO_L10P_T1_AD11P_35)
BIO_11_N: U7.L17(IO_L11N_T1_SRCC_35)
BIO_11_P: U7.L16(IO_L11P_T1_SRCC_35)
BIO_12_N: CN2.31 U7.K18(IO_L12N_T1_MRCC_35)
BIO_12_P: CN2.29 U7.K17(IO_L12P_T1_MRCC_35)
BIO_13_N: CN2.36 U7.H17(IO_L13N_T2_MRCC_35)
BIO_13_P: CN2.34 U7.H16(IO_L13P_T2_MRCC_35)
BIO_14_N: CN2.49 U7.H18(IO_L14N_T2_AD4N_SRCC_35)
BIO_14_P: CN2.47 U7.J18(IO_L14P_T2_AD4P_SRCC_35)
BIO_15_N: CN2.46 U7.F20(IO_L15N_T2_DQS_AD12N_35)
BIO_15_P: CN2.44 U7.F19(IO_L15P_T2_DQS_AD12P_35)
BIO_16_N: U7.G18(IO_L16N_T2_35)
BIO_16_P: U7.G17(IO_L16P_T2_35)
BIO_17_N: CN2.53 U7.H20(IO_L17N_T2_AD5N_35)
BIO_17_P: CN2.51 U7.J20(IO_L17P_T2_AD5P_35)
BIO_18_N: CN2.54 U7.G20(IO_L18N_T2_AD13N_35)
BIO_18_P: CN2.52 U7.G19(IO_L18P_T2_AD13P_35)
BIO_19_N: CN2.35 U7.G15(IO_L19N_T3_VREF_35)
BIO_19_P: CN2.33 U7.H15(IO_L19P_T3_35)
BIO_20_N: CN2.27 U7.J14(IO_L20N_T3_AD6N_35)
BIO_20_P: CN2.25 U7.K14(IO_L20P_T3_AD6P_35)
BIO_21_N: U7.N16(IO_L21N_T3_DQS_AD14N_35)
BIO_21_P: U7.N15(IO_L21P_T3_DQS_AD14P_35)
BIO_22_N: U7.L15(IO_L22N_T3_AD7N_35)
BIO_22_P: R82.2 U7.L14(IO_L22P_T3_AD7P_35)
BIO_23_N: U7.M15(IO_L23N_T3_35)
BIO_23_P: U7.M14(IO_L23P_T3_35)
BIO_24_N: CN2.23 U7.J16(IO_L24N_T3_AD15N_35)
BIO_24_P: CN2.21 U7.K16(IO_L24P_T3_AD15P_35)
BIO_25: U7.J15(IO_25_35)
CC1: R80.2 USB1.A5(CC1)
CC2: R79.2 USB1.B5(CC2)
DDR_A0: RN4.2 U5.N3(A0) U7.N2(PS_DDR_A0_502)
DDR_A1: RN2.1 U5.P7(A1) U7.K2(PS_DDR_A1_502)
DDR_A2: RN5.2 U5.P3(A2) U7.M3(PS_DDR_A2_502)
DDR_A3: RN6.4 U5.N2(A3) U7.K3(PS_DDR_A3_502)
DDR_A4: RN1.2 U5.P8(A4) U7.M4(PS_DDR_A4_502)
DDR_A5: RN5.1 U5.P2(A5) U7.L1(PS_DDR_A5_502)
DDR_A6: RN1.1 U5.R8(A6) U7.L4(PS_DDR_A6_502)
DDR_A7: RN5.3 U5.R2(A7) U7.K4(PS_DDR_A7_502)
DDR_A8: RN2.4 U5.T8(A8) U7.K1(PS_DDR_A8_502)
DDR_A9: RN5.4 U5.R3(A9) U7.J4(PS_DDR_A9_502)
DDR_A10: RN3.3 U5.L7(A10/AP) U7.F5(PS_DDR_A10_502)
DDR_A11: RN2.3 U5.R7(A11) U7.G4(PS_DDR_A11_502)
DDR_A12: RN3.4 U5.N7(A12/BC#) U7.E4(PS_DDR_A12_502)
DDR_A13: RN4.1 U5.T3(A13) U7.D4(PS_DDR_A13_502)
DDR_A14: RN2.2 U5.T7(A14) U7.F4(PS_DDR_A14_502)
DDR_BA0: RN6.3 U5.M2(BA0) U7.L5(PS_DDR_BA0_502)
DDR_BA1: RN1.3 U5.N8(BA1) U7.R4(PS_DDR_BA1_502)
DDR_BA2: RN4.3 U5.M3(BA2) U7.J5(PS_DDR_BA2_502)
DDR_CAS: RN3.1 U5.K3(CAS#) U7.P5(PS_DDR_CAS_B_502)
DDR_CKE: RN1.4 U5.K9(CKE) U7.N3(PS_DDR_CKE_502)
DDR_CLK_N: R22.2 U5.K7(CK#) U7.M2(PS_DDR_CKN_502)
DDR_CLK_P: R22.1 U5.J7(CK) U7.L2(PS_DDR_CKP_502)
DDR_CS: RN6.2 U5.L2(CS#) U7.N1(PS_DDR_CS_B_502)
DDR_D0: U5.E3(DQ0) U7.C3(PS_DDR_DQ0_502)
DDR_D1: U5.F7(DQ1) U7.B3(PS_DDR_DQ1_502)
DDR_D2: U5.F2(DQ2) U7.A2(PS_DDR_DQ2_502)
DDR_D3: U5.F8(DQ3) U7.A4(PS_DDR_DQ3_502)
DDR_D4: U5.H3(DQ4) U7.D3(PS_DDR_DQ4_502)
DDR_D5: U5.H8(DQ5) U7.D1(PS_DDR_DQ5_502)
DDR_D6: U5.G2(DQ6) U7.C1(PS_DDR_DQ6_502)
DDR_D7: U5.H7(DQ7) U7.E1(PS_DDR_DQ7_502)
DDR_D8: U5.D7(DQ8) U7.E2(PS_DDR_DQ8_502)
DDR_D9: U5.C3(DQ9) U7.E3(PS_DDR_DQ9_502)
DDR_D10: U5.C8(DQ10) U7.G3(PS_DDR_DQ10_502)
DDR_D11: U5.C2(DQ11) U7.H3(PS_DDR_DQ11_502)
DDR_D12: U5.A7(DQ12) U7.J3(PS_DDR_DQ12_502)
DDR_D13: U5.A2(DQ13) U7.H2(PS_DDR_DQ13_502)
DDR_D14: U5.B8(DQ14) U7.H1(PS_DDR_DQ14_502)
DDR_D15: U5.A3(DQ15) U7.J1(PS_DDR_DQ15_502)
DDR_DM0: U5.E7(LDM) U7.A1(PS_DDR_DM0_502)
DDR_DM1: U5.D3(UDM) U7.F1(PS_DDR_DM1_502)
DDR_DQS0_N: U5.G3(LDQS#) U7.B2(PS_DDR_DQS_N0_502)
DDR_DQS0_P: U5.F3(LDQS) U7.C2(PS_DDR_DQS_P0_502)
DDR_DQS1_N: U5.B7(UDQS#) U7.F2(PS_DDR_DQS_N1_502)
DDR_DQS1_P: U5.C7(UDQS) U7.G2(PS_DDR_DQS_P1_502)
DDR_ODT: RN6.1 U5.K1(ODT) U7.N5(PS_DDR_ODT_502)
DDR_RAS: RN3.2 U5.J3(RAS#) U7.P4(PS_DDR_RAS_B_502)
DDR_RESET: R21.2 U5.T2(RESET#) U7.B4(PS_DDR_DRST_B_502)
DDR_WE: RN4.4 U5.L3(WE#) U7.M5(PS_DDR_WE_B_502)
DDRVTT: C31.2 C32.2 C33.2 C34.2 C35.1 C38.1 C39.1 C40.1 R23.2 R24.1 RN1.5 RN1.6 RN1.7 RN1.8 RN2.5 RN2.6 RN2.7 RN2.8 RN3.5 RN3.6 RN3.7 RN3.8 RN4.5 RN4.6 RN4.7 RN4.8 RN5.5 RN5.6 RN5.7 RN5.8 RN6.5 RN6.6 RN6.7 RN6.8
DONE: R77.2 R78.2 U7.R11(DONE_0)
ETH_RX_CLK: U7.B17(PS_MIO22_501)
ETH_RXCTL: U7.D13(PS_MIO27_501)
ETH_RXD0: U7.D11(PS_MIO23_501)
ETH_RXD1: U7.A16(PS_MIO24_501)
ETH_RXD2: U7.F15(PS_MIO25_501)
ETH_RXD3: U7.A15(PS_MIO26_501)
ETH_TX_CLK: U7.A19(PS_MIO16_501)
ETH_TXCTL: U7.F14(PS_MIO21_501)
ETH_TXD0: U7.E14(PS_MIO17_501)
ETH_TXD1: U7.B18(PS_MIO18_501)
ETH_TXD2: U7.D10(PS_MIO19_501)
ETH_TXD3: U7.A17(PS_MIO20_501)
JTAG_TCK: CN1.3 CN3.3 R87.1 U7.F9(TCK_0)
JTAG_TDI: CN1.6 CN3.5 R85.1 U7.G6(TDI_0)
JTAG_TDO: CN1.5 CN3.4 R86.1 U7.F6(TDO_0)
JTAG_TMS: CN1.4 CN3.6 R84.1 U7.J6(TMS_0)
MIO7: R33.2 U7.D8(PS_MIO7_500)
MIO8: R28.2 U7.D5(PS_MIO8_500)
PG_1V0: R4.2 U1.7(PG) U2.1(EN)
PG_1V5: R12.1 U3.1(EN) U4.7(PG)
PG_1V8: R5.2 U2.7(PG) U4.1(EN)
PG_3V3: R11.2 R81.2 U3.7(PG)
PL_CLK: U7.U15(IO_L11N_T1_SRCC_34) X2.3(OUT)
PS_CLK: R27.2 U7.E7(PS_CLK_500)
QSPI_CLK: R32.2 R39.2 U10.6(CLK)
QSPI_CS: R29.2 U7.A7(PS_MIO1_500) U10.1(/CS)
QSPI_D0: R30.2 U7.B8(PS_MIO2_500) U10.5(DI(IO0))
QSPI_D1: R31.2 U7.D6(PS_MIO3_500) U10.2(DO(IO1))
QSPI_D2: R74.2 U7.B7(PS_MIO4_500) U10.3(/WP(IO2))
QSPI_D3: R73.2 U7.A6(PS_MIO5_500) U10.7(/HOLDor/RESET(IO3))
SD_CD: U7.B14(PS_MIO47_501)
SD_CLK: CN2.8 R40.2 U8.9(CLKA)
SD_CMD: CN2.3 U7.C17(PS_MIO41_501) U8.4(CMDA)
SD_D0: CN2.6 U7.E12(PS_MIO42_501) U8.6(DAT0A)
SD_D1: CN2.4 U7.A9(PS_MIO43_501) U8.7(DAT1A)
SD_D2: CN2.7 U7.F13(PS_MIO44_501) U8.1(DAT2A)
SD_D3: CN2.5 U7.B15(PS_MIO45_501) U8.3(DAT3A)
SDO_CLK: U8.19(CLKB0)
SDO_CMD: R43.1 U8.20(CMDB0)
SDO_D0: U8.18(DAT0B0)
SDO_D1: U8.16(DAT1B0)
SDO_D2: U8.23(DAT2B0)
SDO_D3: R42.1 U8.22(DAT3B0)
UART1_RX: U7.C12(PS_MIO49_501) U9.4(TXD)
UART1_TX: U7.B12(PS_MIO48_501) U9.5(RXD)
USB_5V: C55.1 C57.2 R83.1 U9.3(VDD5) U9.9(VBUS) USB1.A4(VBUS) USB1.A9(VBUS) USB1.B4(VBUS) USB1.B9(VBUS)
USB_DN: U9.8(UD-) USB1.A7(DN1) USB1.B7(DN2)
USB_DP: U9.7(UD+) USB1.A6(DP1) USB1.B6(DP2)
VPLL: L3.1 U7.G8(VCCPLL)
VREF_DDR: C36.2 C37.1 C42.2 C43.1 R25.2 R26.1 U5.H1(VREFDQ) U5.M8(VREFCA)
$1N14580: R2.2 U7.L6(PROGRAM_B_0)
$1N14633: R1.2 U7.R10(INIT_B_0)
$1N24340: C80.1 L7.1 X2.4(VDD)
$2N19190: C2.1 U1.8(SS/TR)
$2N19490: R7.1 R8.2 U1.6(FB)
$2N19931: C3.1 U2.8(SS/TR)
$2N19946: R9.1 R10.2 U2.6(FB)
$2N20252: C9.1 U3.8(SS/TR)
$2N20265: R13.1 R14.2 U3.6(FB)
$2N20571: C10.1 U4.8(SS/TR)
$2N20584: R15.1 R16.2 U4.6(FB)
$2N23390: C1.1 R3.1 R6.2 U7.H6(PS_DDR_VREF0_502) U7.P6(PS_DDR_VREF1_502)
$2N25176: LED2.2(A) R81.1
$2N29391: C7.1 L1.3(OUT) R8.1 U1.4(VOUT) U1.5(VOUT)
$2N29406: C8.1 L2.3(OUT) R10.1 U2.4(VOUT) U2.5(VOUT)
$2N29421: C13.1 L4.3(OUT) R14.1 U3.4(VOUT) U3.5(VOUT)
$2N29436: C14.1 L5.3(OUT) R16.1 U4.4(VOUT) U4.5(VOUT)
$3N4861: R18.1 U5.L8(ZQ)
$3N6630: R20.2 U7.G5(PS_DDR_VRN_502)
$3N6631: R19.2 U7.H5(PS_DDR_VRP_502)
$4N1339: C44.1 C45.1 L6.1 X1.4(VCC)
$4N1613: R27.1 X1.3(OUT)
$4N4858: R34.1 U7.B10(PS_SRST_B_501)
$4N10916: R36.2 U7.C7(PS_POR_B_500)
$4N10977: R39.1 U7.A5(PS_MIO6_500)
$4N13692: R40.1 U7.D14(PS_MIO40_501)
$4N19031: R73.1 R76.1 SW1.3(B2)
$4N19041: R74.1 R75.1 SW1.4(B1)
$4N20015: LED1.2(A) R77.1
$4N20949: LED3.2(A) R82.1
$4N37603: C54.2 U9.6(V3)
$4N38914: C48.1 R37.1 R38.2 U7.E11(PS_MIO_VREF_501)
Net-(R41-2): R41.2 U8.24(SEL)

Not connected (* = marked no-connect by the designer): CN1 7* 8* 9* 10* 11* 13*; CN2 9* 10* 11* 12* 13* 14* 15* 16* 17* 18* 22* 24* 26* 28*; U5 J1(NC)* J9(NC)* L1(NC)* L9(NC)* M7(NC)*; U7 A10(PS_MIO37_501) A11(PS_MIO36_501) A12(PS_MIO34_501) A14(PS_MIO32_501) B5(PS_MIO9_500)* B9(PS_MIO51_501) B13(PS_MIO50_501) C5(PS_MIO14_500)* C6(PS_MIO11_500)* C8(PS_MIO15_500)* C10(PS_MIO52_501) C11(PS_MIO53_501) C13(PS_MIO29_501) C15(PS_MIO30_501) C16(PS_MIO28_501) C18(PS_MIO39_501) D9(PS_MIO12_500)* D15(PS_MIO33_501) D16(PS_MIO46_501)* E6(PS_MIO0_500) E8(PS_MIO13_500)* E9(PS_MIO10_500)* E13(PS_MIO38_501) E16(PS_MIO31_501) F12(PS_MIO35_501) K9(VP_0)* L10(VN_0)* P1(PS_DDR_DQ16_502)* P3(PS_DDR_DQ17_502)* R1(PS_DDR_DQ19_502)* R2(PS_DDR_DQS_P2_502)* R3(PS_DDR_DQ18_502)* T1(PS_DDR_DM2_502)* T2(PS_DDR_DQS_N2_502)* T4(PS_DDR_DQ20_502)* T5(NC)* T9(NC)* U2(PS_DDR_DQ22_502)* U3(PS_DDR_DQ23_502)* U4(PS_DDR_DQ21_502)* U5(NC)* U7(NC)* U8(NC)* U9(NC)* U10(NC)* V1(PS_DDR_DQ24_502)* V2(PS_DDR_DQ30_502)* V3(PS_DDR_DQ31_502)* V5(NC)* V6(NC)* V7(NC)* V8(NC)* V10(NC)* V11(NC)* W1(PS_DDR_DQ26_502)* W3(PS_DDR_DQ29_502)* W4(PS_DDR_DQS_N3_502)* W5(PS_DDR_DQS_P3_502)* W6(NC)* W8(NC)* W9(NC)* W10(NC)* W11(NC)* Y1(PS_DDR_DM3_502)* Y2(PS_DDR_DQ28_502)* Y3(PS_DDR_DQ25_502)* Y4(PS_DDR_DQ27_502)* Y6(NC)* Y7(NC)* Y8(NC)* Y9(NC)* Y11(NC)* Y12(NC)* Y13(NC)*; U8 8(DAT2B1)* 10(DAT3B1)* 12(CMDB1)* 13(CLKB1)* 14(DAT0B1)* 15(DAT1B1)*; U9 10(ACT#)* 11(DCD)* 12(DTRTNOW)* 13(RTS)* 14(DSR)* 15(CTS)* 16(RI)*; U11 2(DOUT)*; USB1 A8(SBU1)* B8(SBU2)*; X1 1(ST#)*; X2 1(E/D)*

## Notes on the sheets
sheet 1
- ZYNQ7020clg400/7010clg400通用
- BANK34
- BANK35
- BTB CONNECTORS
- TO U15
- PL CLK
sheet 2
- CORE 1V0
- VAUX 1V8
- POWER GOOD LED
- BANK 3V3
- DDR 1V5
- Decoupling
- ZYNQ POWER
sheet 3
- 对于ZYNQ驱动单片DDR 终端电阻可不加
- BANK502
- NO FIT
- DDR
- DDR CONFIG
- NO FIT
sheet 4
- T16
- L14
- RGB LED
- SD
- USB-UART
- PS Clock
- QSPI FLASH
- BOOT MODE
- JTAG
- BANK 500/501
sheet 5
- 1. 移除多余的铺铜
- 2. TX/RX 等长
- 3. QSPI 等长
- 4. JTAG 等长
- 5. 修改了电源网络布线
- 6. 移除地内层平面所有不必要的走线
- 7. 调整元件布局
- 8. 移除 SD 卡电平匹配芯片（由母板提供）
